# EAGLE design electrosteel2020_10_arrange6_synthboardsonly (EAGLE 9.6.2)
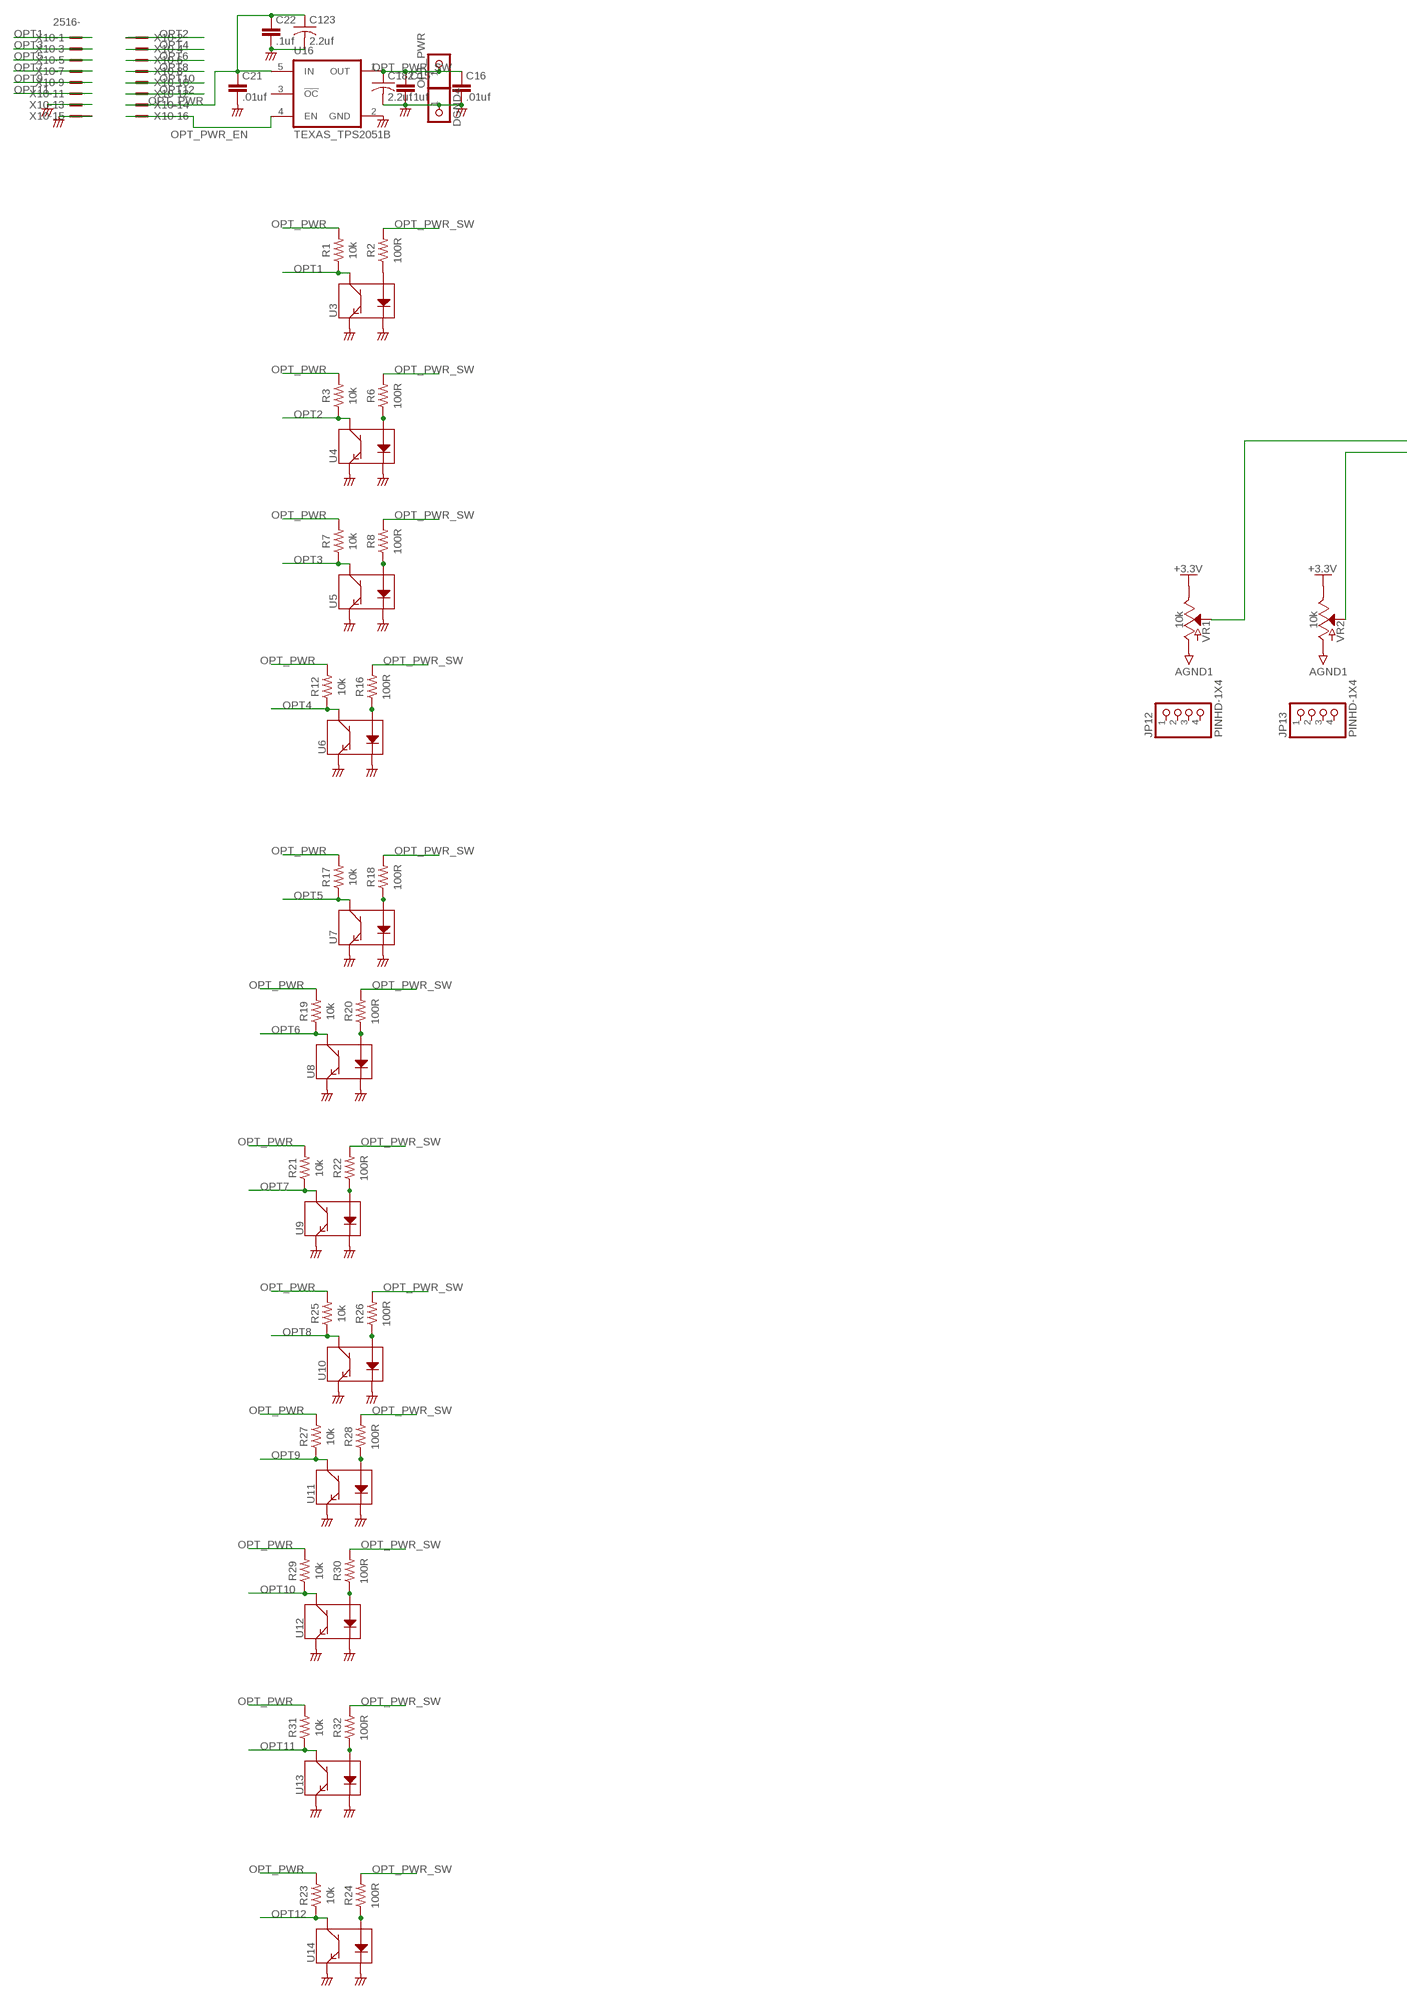
[diagram p0: schematic, sheet 1, part 1 of 3]
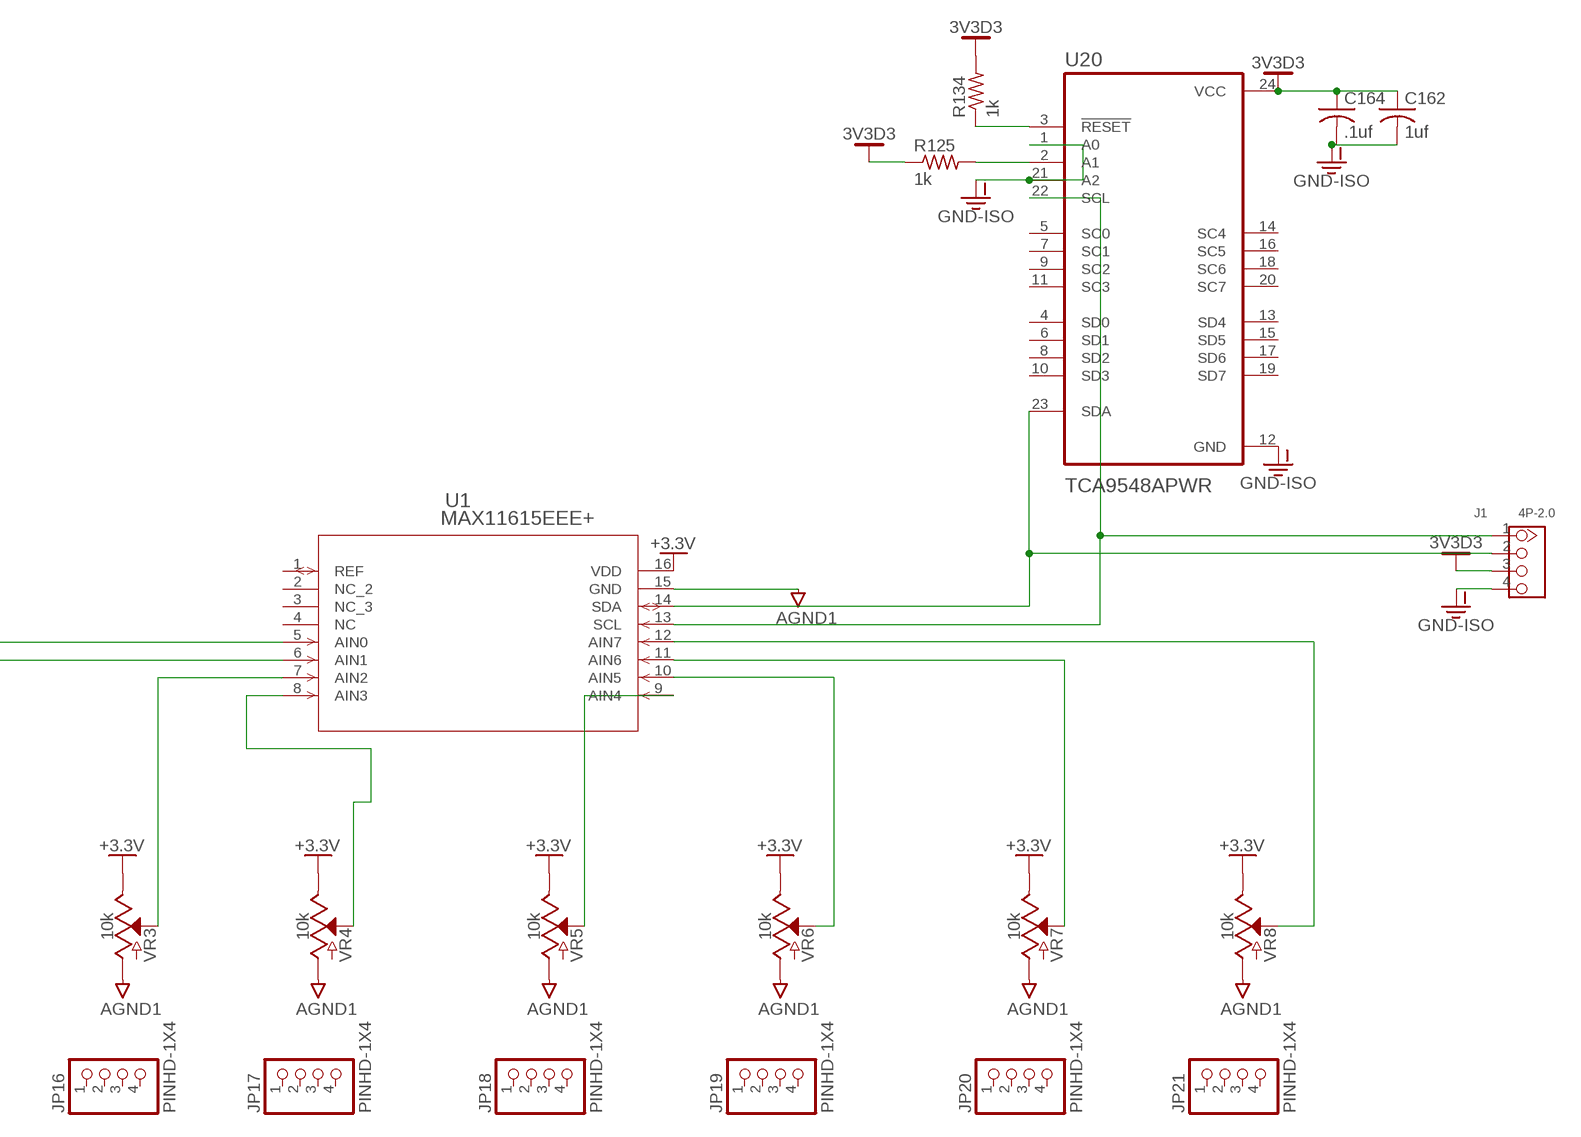
[diagram p1: schematic, sheet 1, part 2 of 3]
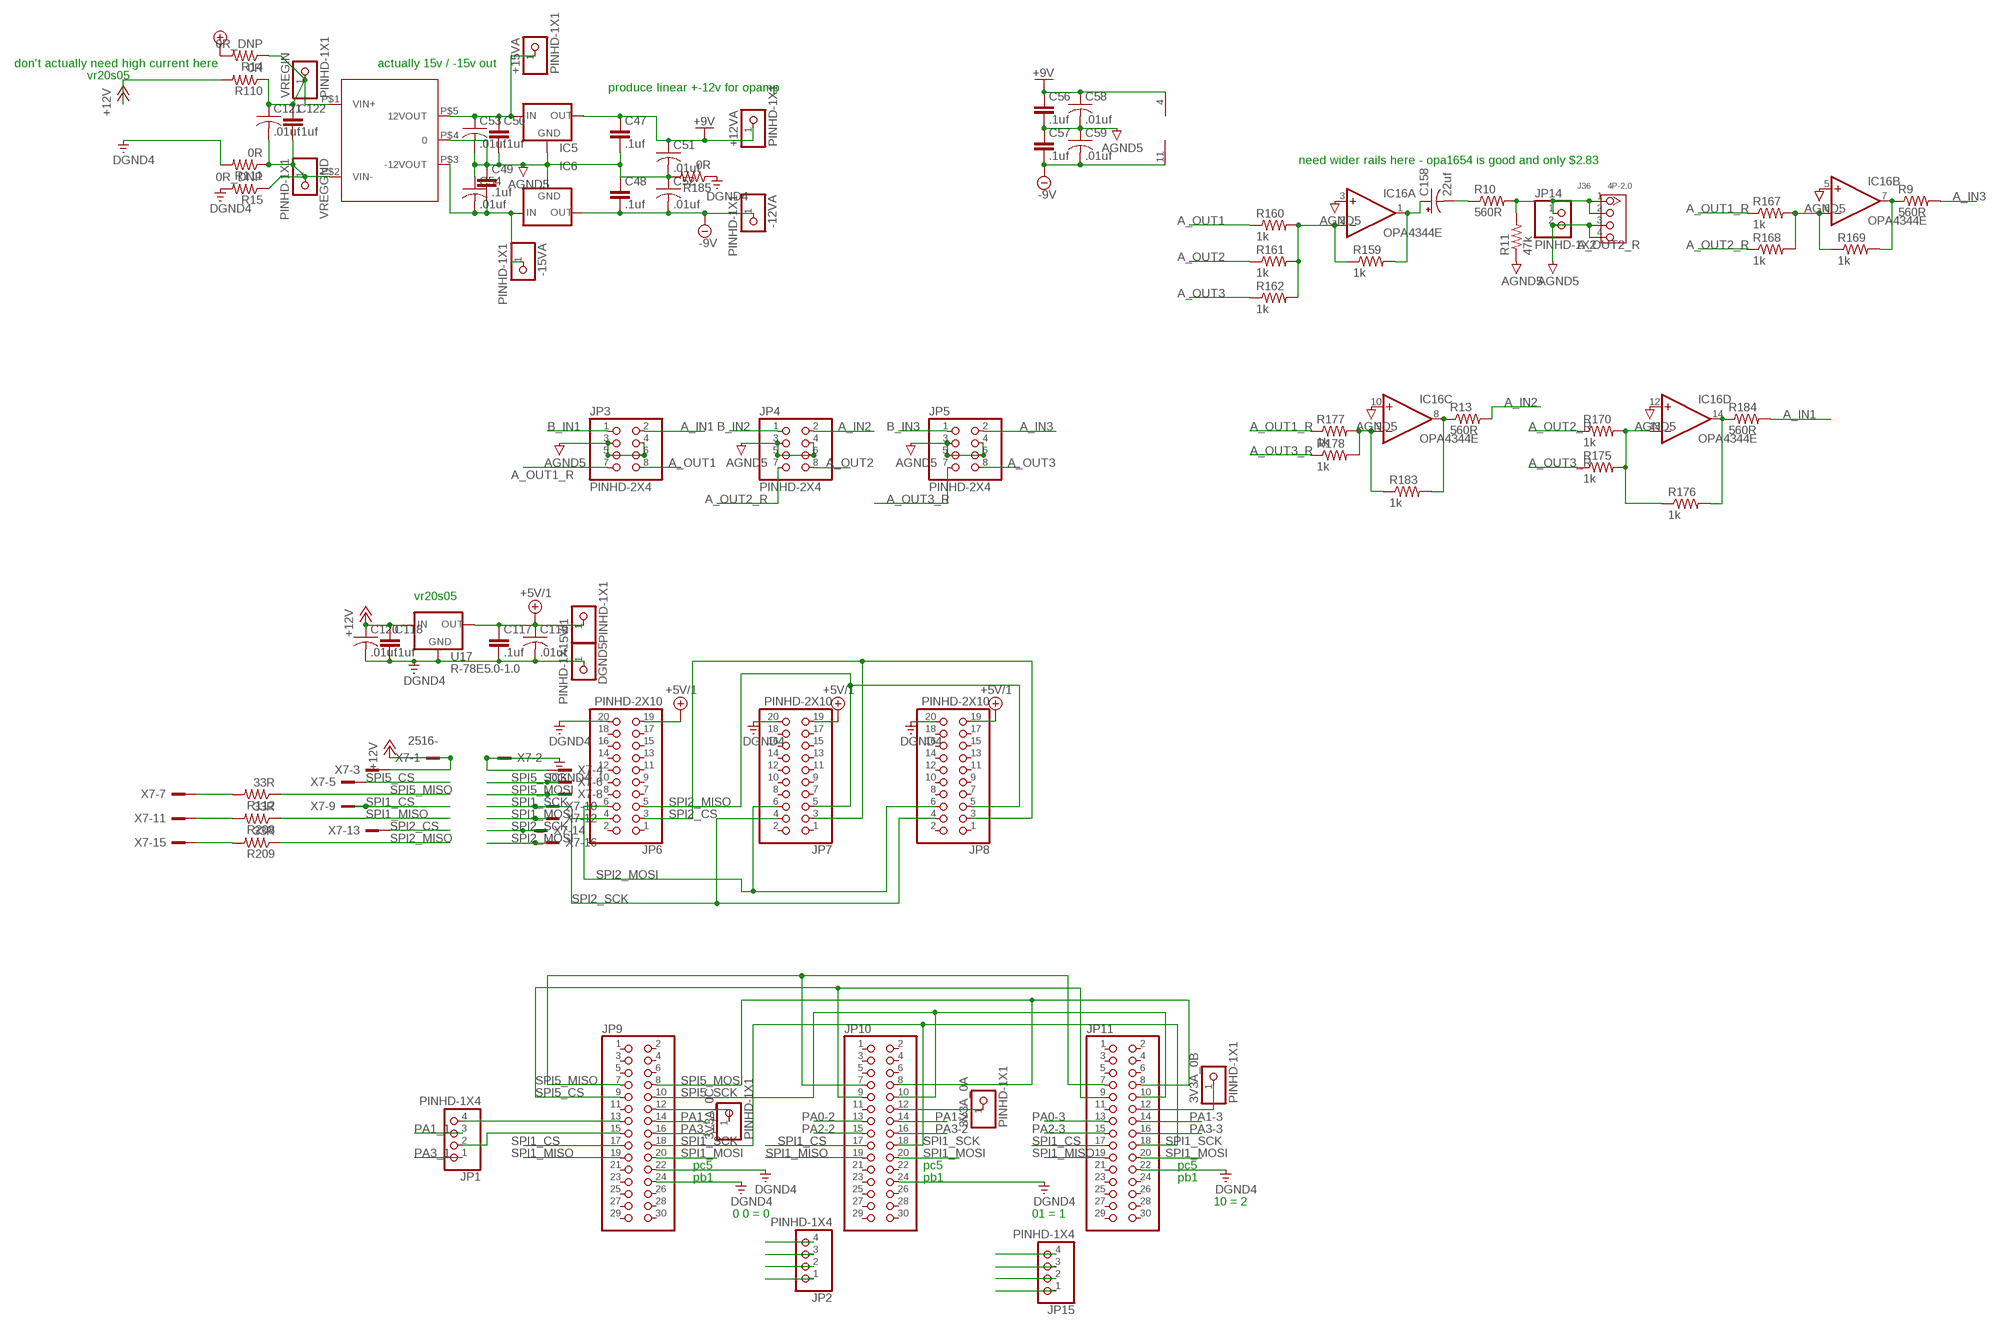
[diagram p2: schematic, sheet 1, part 3 of 3]

## Parts
3V3A_0A  PINHD-1X1  [1X01]
3V3A_0B  PINHD-1X1  [1X01]
3V3A_0C  PINHD-1X1  [1X01]
5V/1  PINHD-1X1  [1X01]
+12VA  PINHD-1X1  [1X01]
+15VA  PINHD-1X1  [1X01]
-12VA  PINHD-1X1  [1X01]
-15VA  PINHD-1X1  [1X01]
C15  .1uf  CAP_0402  [0402]
C16  .01uf  CAP_0402  [0402]
C21  .01uf  CAP_0402  [0402]
C22  .1uf  CAP_0402  [0402]
C47  .1uf  CAP_0402  [0402]
C48  .1uf  CAP_0402  [0402]
C49  .1uf  CAP_0402  [0402]
C50  .1uf  CAP_0402  [0402]
C51  .01uf  C-USC0201  [C0201]
C52  .01uf  C-USC0201  [C0201]
C53  .01uf  C-USC0201  [C0201]
C54  .01uf  C-USC0201  [C0201]
C56  .1uf  CAP_0402  [0402]
C57  .1uf  CAP_0402  [0402]
C58  .01uf  C-USC0201  [C0201]
C59  .01uf  C-USC0201  [C0201]
C117  .1uf  CAP_0402  [0402]
C118  .1uf  CAP_0402  [0402]
C119  .01uf  C-USC0201  [C0201]
C120  .01uf  C-USC0201  [C0201]
C121  .01uf  C-USC0201  [C0201]
C122  .1uf  CAP_0402  [0402]
C123  2.2uf  C-USC1206  [C1206]
C158  22uf  CPOL-USD  [PANASONIC_D]
C162  1uf  C-USC1206K  [C1206K]
C164  .1uf  C-USC0603K  [C0603K]
C182  2.2uf  C-USC1206  [C1206]
DGND4  PINHD-1X1  [1X01]
DGND5  PINHD-1X1  [1X01]
IC5  78LXX  [78LXX]
IC6  79LXX  [79LXX]
IC16  OPA4344E  [TSSOP14]
J1  4P-2.0  GROVE-CONNECTOR-DIP(4P-2.0)  [HW4-2.0]
J36  4P-2.0  GROVE-CONNECTOR-DIP(4P-2.0)  [HW4-2.0]
JP1  PINHD-1X4  [1X04]
JP2  PINHD-1X4  [1X04]
JP3  PINHD-2X4  [2X04]
JP4  PINHD-2X4  [2X04]
JP5  PINHD-2X4  [2X04]
JP6  PINHD-2X10  [2X10]
JP7  PINHD-2X10  [2X10]
JP8  PINHD-2X10  [2X10]
JP9  PINHD-2X15  [2X15]
JP10  PINHD-2X15  [2X15]
JP11  PINHD-2X15  [2X15]
JP12  PINHD-1X4  [1X04]
JP13  PINHD-1X4  [1X04]
JP14  PINHD-1X2  [1X02]
JP15  PINHD-1X4  [1X04]
JP16  PINHD-1X4  [1X04]
JP17  PINHD-1X4  [1X04]
JP18  PINHD-1X4  [1X04]
JP19  PINHD-1X4  [1X04]
JP20  PINHD-1X4  [1X04]
JP21  PINHD-1X4  [1X04]
OPT_PWR  PINHD-1X1  [1X01]
R1  10k  R-US_CHIP-0603(1608-METRIC)  [RESC1608X60]
R2  100R  R-US_CHIP-0603(1608-METRIC)  [RESC1608X60]
R3  10k  R-US_CHIP-0603(1608-METRIC)  [RESC1608X60]
R6  100R  R-US_CHIP-0603(1608-METRIC)  [RESC1608X60]
R7  10k  R-US_CHIP-0603(1608-METRIC)  [RESC1608X60]
R8  100R  R-US_CHIP-0603(1608-METRIC)  [RESC1608X60]
R9  560R  R-US_R0603  [R0603]
R10  560R  R-US_R0603  [R0603]
R11  47k  R-US_R0603  [R0603]
R12  10k  R-US_CHIP-0603(1608-METRIC)  [RESC1608X60]
R13  560R  R-US_R0603  [R0603]
R14  0R_DNP  R-US_R0603  [R0603]
R15  0R_DNP  R-US_R0603  [R0603]
R16  100R  R-US_CHIP-0603(1608-METRIC)  [RESC1608X60]
R17  10k  R-US_CHIP-0603(1608-METRIC)  [RESC1608X60]
R18  100R  R-US_CHIP-0603(1608-METRIC)  [RESC1608X60]
R19  10k  R-US_CHIP-0603(1608-METRIC)  [RESC1608X60]
R20  100R  R-US_CHIP-0603(1608-METRIC)  [RESC1608X60]
R21  10k  R-US_CHIP-0603(1608-METRIC)  [RESC1608X60]
R22  100R  R-US_CHIP-0603(1608-METRIC)  [RESC1608X60]
R23  10k  R-US_CHIP-0603(1608-METRIC)  [RESC1608X60]
R24  100R  R-US_CHIP-0603(1608-METRIC)  [RESC1608X60]
R25  10k  R-US_CHIP-0603(1608-METRIC)  [RESC1608X60]
R26  100R  R-US_CHIP-0603(1608-METRIC)  [RESC1608X60]
R27  10k  R-US_CHIP-0603(1608-METRIC)  [RESC1608X60]
R28  100R  R-US_CHIP-0603(1608-METRIC)  [RESC1608X60]
R29  10k  R-US_CHIP-0603(1608-METRIC)  [RESC1608X60]
R30  100R  R-US_CHIP-0603(1608-METRIC)  [RESC1608X60]
R31  10k  R-US_CHIP-0603(1608-METRIC)  [RESC1608X60]
R32  100R  R-US_CHIP-0603(1608-METRIC)  [RESC1608X60]
R110  0R  R-US_R0603  [R0603]
R111  0R  R-US_R0603  [R0603]
R112  33R  R-US_R0201  [R0201]
R125  1k  R-US_R0603  [R0603]
R134  1k  R-US_R0603  [R0603]
R159  1k  R-US_R0603  [R0603]
R160  1k  R-US_R0603  [R0603]
R161  1k  R-US_R0603  [R0603]
R162  1k  R-US_R0603  [R0603]
R167  1k  R-US_R0603  [R0603]
R168  1k  R-US_R0603  [R0603]
R169  1k  R-US_R0603  [R0603]
R170  1k  R-US_R0603  [R0603]
R175  1k  R-US_R0603  [R0603]
R176  1k  R-US_R0603  [R0603]
R177  1k  R-US_R0603  [R0603]
R178  1k  R-US_R0603  [R0603]
R183  1k  R-US_R0603  [R0603]
R184  560R  R-US_R0603  [R0603]
R185  0R  R-US_R0603  [R0603]
R208  33R  R-US_R0201  [R0201]
R209  33R  R-US_R0201  [R0201]
U1  MAX11615EEE+  [21-0055H_16_MXM]
U3  QRE1113  [QRE1113]
U4  QRE1113  [QRE1113]
U5  QRE1113  [QRE1113]
U6  QRE1113  [QRE1113]
U7  QRE1113  [QRE1113]
U8  QRE1113  [QRE1113]
U9  QRE1113  [QRE1113]
U10  QRE1113  [QRE1113]
U11  QRE1113  [QRE1113]
U12  QRE1113  [QRE1113]
U13  QRE1113  [QRE1113]
U14  QRE1113  [QRE1113]
U16  TEXAS_TPS2051B  [TEXAS_SOT23-5]
U17  R-78E5.0-1.0  [DC-DC_CONVERTER_78XX]
U20  TCA9548APWR  [SOP65P640X120-24N]
U$3  CMR0512S3C  [CMR0512S3C]
VR1  10k  POTENTIOMETER-PTH-9MM-1/20W-20%  [POT-PTH-ALPS]
VR2  10k  POTENTIOMETER-PTH-9MM-1/20W-20%  [POT-PTH-ALPS]
VR3  10k  POTENTIOMETER-PTH-9MM-1/20W-20%  [POT-PTH-ALPS]
VR4  10k  POTENTIOMETER-PTH-9MM-1/20W-20%  [POT-PTH-ALPS]
VR5  10k  POTENTIOMETER-PTH-9MM-1/20W-20%  [POT-PTH-ALPS]
VR6  10k  POTENTIOMETER-PTH-9MM-1/20W-20%  [POT-PTH-ALPS]
VR7  10k  POTENTIOMETER-PTH-9MM-1/20W-20%  [POT-PTH-ALPS]
VR8  10k  POTENTIOMETER-PTH-9MM-1/20W-20%  [POT-PTH-ALPS]
VREGGND  PINHD-1X1  [1X01]
VREGIN  PINHD-1X1  [1X01]
X7  2516-  [PAK100/2500-16]
X10  2516-  [PAK100/2500-16]

## Nets
3V3D3: C162.1 C164.1 J1.3 R125.1 R134.2 U20.24(VCC)
+3.3V: U1.16(VDD) VR1.P$1(E) VR2.P$1(E) VR3.P$1(E) VR4.P$1(E) VR5.P$1(E) VR6.P$1(E) VR7.P$1(E) VR8.P$1(E)
+5V/1: 5V/1.1 C117.1 C119.1 JP6.19 JP7.19 JP8.19 R14.2 U17.VOUT(OUT)
+9V: +12VA.1 C47.1 C51.1 C56.1 C58.1 IC5.OUT IC16.4(P:V+)
+12V: C118.1 C120.1 R110.2 U17.VIN(IN) X7.1 X7.3
-9V: -12VA.1 C48.2 C52.2 C57.2 C59.2 IC6.OUT IC16.11(P:V-)
A_IN1: JP3.2 R184.2
A_IN2: JP4.2 R13.2
A_IN3: JP5.2 R9.2
A_OUT1: JP3.8 R160.1
A_OUT1_R: JP3.7 R167.1 R177.1
A_OUT2: JP4.8 R161.1
A_OUT2_R: JP4.7 R168.1 R170.1
A_OUT3: JP5.8 R162.1
A_OUT3_R: JP5.7 R175.1 R178.1
AGND1: U1.15(GND) VR1.P$3(A) VR2.P$3(A) VR3.P$3(A) VR4.P$3(A) VR5.P$3(A) VR6.P$3(A) VR7.P$3(A) VR8.P$3(A)
AGND5: C47.2 C48.1 C49.1 C50.2 C51.2 C52.1 C53.2 C54.1 C56.2 C57.1 C58.2 C59.1 IC5.GND IC6.GND IC16.3(A:+IN) IC16.5(B:+IN) IC16.10(C:+IN) IC16.12(D:+IN) J36.3 J36.4 JP3.3 JP3.4 JP3.5 JP3.6 JP4.3 JP4.4 JP4.5 JP4.6 JP5.3 JP5.4 JP5.5 JP5.6 JP14.2 R11.1 R185.2 U$3.P$4
B_IN1: JP3.1
B_IN2: JP4.1
B_IN3: JP5.1
CGND: C15.2 C16.2 C21.2 C22.2 C123.2 C182.2 DGND4.1 U3.2(K) U3.4(E) U4.2(K) U4.4(E) U5.2(K) U5.4(E) U6.2(K) U6.4(E) U7.2(K) U7.4(E) U8.2(K) U8.4(E) U9.2(K) U9.4(E) U10.2(K) U10.4(E) U11.2(K) U11.4(E) U12.2(K) U12.4(E) U13.2(K) U13.4(E) U14.2(K) U14.4(E) U16.2(GND) X10.13 X10.15 ; supply symbol labelled SUPPLY0_CGND_
DGND4: C117.2 C118.2 C119.2 C120.2 DGND5.1 JP6.20 JP7.20 JP8.20 JP9.22 JP9.24 JP10.24 JP11.22 R15.2 R111.2 R185.1 U17.GND X7.2 X7.4
GND-ISO: C162.2 C164.2 J1.4 U20.1(A0) U20.12(GND) U20.21(A2)
N$1: R6.1 U4.1(A)
N$2: R2.1 U3.1(A)
N$3: U1.5(AIN0) VR1.P$2(S)
N$4: U1.6(AIN1) VR2.P$2(S)
N$5: U1.7(AIN2) VR3.P$2(S)
N$6: U1.8(AIN3) VR4.P$2(S)
N$7: R8.1 U5.1(A)
N$8: U1.9(AIN4) VR5.P$2(S)
N$9: U1.10(AIN5) VR6.P$2(S)
N$10: IC16.6(B:-IN) R167.2 R168.2 R169.1
N$11: U1.11(AIN6) VR7.P$2(S)
N$12: U1.12(AIN7) VR8.P$2(S)
N$13: J1.2 U1.14(SDA) U20.23(SDA)
N$14: J1.1 U1.13(SCL) U20.22(SCL)
N$15: R125.2 U20.2(A1)
N$27: IC16.2(A:-IN) R159.1 R160.2 R161.2 R162.2
N$28: IC16.7(B:OUT) R9.1 R169.2
N$29: IC16.9(C:-IN) R177.2 R178.2 R183.1
N$30: +15VA.1 C50.1 C53.1 IC5.IN U$3.P$5(12VOUT)
N$32: C158.+ IC16.1(A:OUT) R159.2
N$33: R16.1 U6.1(A)
N$34: -15VA.1 C49.2 C54.2 IC6.IN U$3.P$3(-12VOUT)
N$35: R18.1 U7.1(A)
N$36: R20.1 U8.1(A)
N$37: R22.1 U9.1(A)
N$38: R24.1 U14.1(A)
N$39: R26.1 U10.1(A)
N$40: R28.1 U11.1(A)
N$41: R30.1 U12.1(A)
N$42: R32.1 U13.1(A)
N$105: C121.2 C122.2 R15.1 R111.1 U$3.P$2(VIN-) VREGGND.1
N$106: C121.1 C122.1 R14.1 R110.1 U$3.P$1(VIN+) VREGIN.1
N$174: R134.1 U20.3(!RESET)
N$246: IC16.8(C:OUT) R13.1 R183.2
N$249: C158.- R10.1
N$251: IC16.14(D:OUT) R176.2 R184.1
N$252: IC16.13(D:-IN) R170.2 R175.2 R176.1
N$265: J36.1 J36.2 JP14.1 R10.2 R11.2
N$284: R209.2 X7.15
N$293: R208.2 X7.11
N$294: R112.2 X7.7
N$298: JP1.4 JP9.13
N$299: 3V3A_0C.1 JP9.12
N$300: JP1.2 JP9.15
N$309: 3V3A_0A.1 JP10.12
N$310: 3V3A_0B.1 JP11.12
OPT1: R1.1 U3.3(C) X10.1
OPT2: R3.1 U4.3(C) X10.2
OPT3: R7.1 U5.3(C) X10.3
OPT4: R12.1 U6.3(C) X10.4
OPT5: R17.1 U7.3(C) X10.5
OPT6: R19.1 U8.3(C) X10.6
OPT7: R21.1 U9.3(C) X10.7
OPT8: R25.1 U10.3(C) X10.8
OPT9: R27.1 U11.3(C) X10.9
OPT10: R29.1 U12.3(C) X10.10
OPT11: R31.1 U13.3(C) X10.11
OPT12: R23.1 U14.3(C) X10.12
OPT_PWR: C21.1 C22.1 C123.1 R1.2 R3.2 R7.2 R12.2 R17.2 R19.2 R21.2 R23.2 R25.2 R27.2 R29.2 R31.2 U16.5(IN) X10.14
OPT_PWR_EN: U16.4(EN) X10.16
OPT_PWR_SW: C15.1 C16.1 C182.1 OPT_PWR.1 R2.2 R6.2 R8.2 R16.2 R18.2 R20.2 R22.2 R24.2 R26.2 R28.2 R30.2 R32.2 U16.1(OUT)
PA0-2: JP2.4 JP10.13
PA0-3: JP11.13 JP15.4
PA1-2: JP2.3 JP10.14
PA1-3: JP11.14 JP15.3
PA1_1: JP1.3 JP9.14
PA2-2: JP2.2 JP10.15
PA2-3: JP11.15 JP15.2
PA3-2: JP2.1 JP10.16
PA3-3: JP11.16 JP15.1
PA3_1: JP1.1 JP9.16
SPI1_CS: JP9.17 JP10.17 JP11.17 X7.9
SPI1_MISO: JP9.19 JP10.19 JP11.19 R208.1
SPI1_MOSI: JP9.20 JP10.20 JP11.20 X7.12
SPI1_SCK: JP9.18 JP10.18 JP11.18 X7.10
SPI2_CS: JP6.3 JP7.3 JP8.3 X7.13
SPI2_MISO: JP6.5 JP7.5 JP8.5 R209.1
SPI2_MOSI: JP6.6 JP7.6 JP8.6 X7.16
SPI2_SCK: JP6.4 JP7.4 JP8.4 X7.14
SPI5_CS: JP9.9 JP10.9 JP11.9 X7.5
SPI5_MISO: JP9.7 JP10.7 JP11.7 R112.1
SPI5_MOSI: JP9.8 JP10.8 JP11.8 X7.8
SPI5_SCK: JP9.10 JP10.10 JP11.10 X7.6
Unconnected: JP6.1 JP6.2 JP6.7 JP6.8 JP6.9 JP6.10 JP6.11 JP6.12 JP6.13 JP6.14 JP6.15 JP6.16 JP6.17 JP6.18 JP7.1 JP7.2 JP7.7 JP7.8 JP7.9 JP7.10 JP7.11 JP7.12 JP7.13 JP7.14 JP7.15 JP7.16 JP7.17 JP7.18 JP8.1 JP8.2 JP8.7 JP8.8 JP8.9 JP8.10 JP8.11 JP8.12 JP8.13 JP8.14 JP8.15 JP8.16 JP8.17 JP8.18 JP9.1 JP9.2 JP9.3 JP9.4 JP9.5 JP9.6 JP9.11 JP9.21 JP9.23 JP9.25 JP9.26 JP9.27 JP9.28 JP9.29 JP9.30 JP10.1 JP10.2 JP10.3 JP10.4 JP10.5 JP10.6 JP10.11 JP10.21 JP10.22 JP10.23 JP10.25 JP10.26 JP10.27 JP10.28 JP10.29 JP10.30 JP11.1 JP11.2 JP11.3 JP11.4 JP11.5 JP11.6 JP11.11 JP11.21 JP11.23 JP11.24 JP11.25 JP11.26 JP11.27 JP11.28 JP11.29 JP11.30 JP12.1 JP12.2 JP12.3 JP12.4 JP13.1 JP13.2 JP13.3 JP13.4 JP16.1 JP16.2 JP16.3 JP16.4 JP17.1 JP17.2 JP17.3 JP17.4 JP18.1 JP18.2 JP18.3 JP18.4 JP19.1 JP19.2 JP19.3 JP19.4 JP20.1 JP20.2 JP20.3 JP20.4 JP21.1 JP21.2 JP21.3 JP21.4 U1.1(REF) U1.2(NC_2) U1.3(NC_3) U1.4(NC) U16.3(!OC!) U20.4(SD0) U20.5(SC0) U20.6(SD1) U20.7(SC1) U20.8(SD2) U20.9(SC2) U20.10(SD3) U20.11(SC3) U20.13(SD4) U20.14(SC4) U20.15(SD5) U20.16(SC5) U20.17(SD6) U20.18(SC6) U20.19(SD7) U20.20(SC7)

## Notes on the sheet
- don't actually need high current here | actually 15v / -15v out
- vr20s05
- produce linear +-12v for opamp
- need wider rails here - opa1654 is good and only $2.83
- vr20s05
- pc5 | pc5 | pc5
- pb1 | pb1 | pb1
- 10 = 2
- 0 0 = 0 | 01 = 1

## Library data of the parts
3V3A_0A 3V3A_0B 3V3A_0C 5V/1 +12VA +15VA -12VA -15VA DGND5 VREGGND VREGIN = Connector:PINHD-1X1: PIN HEADER; CATEGORY: CONNECTOR; PARTNO: *DNP; SUB-CATEGORY: PIN-HEADER
C15 C22 C47-C50 C56 C57 C117 C118 C122 = Perfect_0402:CAP_0402: 0402 (1005 Metric) Nick Garner - TeleSense; PARTNO: CC0402KRX7R8BB104
C16 C21 = Perfect_0402:CAP_0402: 0402 (1005 Metric) Nick Garner - TeleSense; PARTNO: CC0402KRX7R8BB103
C51-C54 C58 C59 C119-C121 = rcl:C-US: CAPACITOR, American symbol; PARTNO: TMK063B7103KP-F; SPICEPREFIX: C
C123 C182 = adafruit:C-US: CAPACITOR, American symbol; PARTNO: T491A225K020AT
C158 = adafruit:CPOL-US: POLARIZED CAPACITOR, American symbol; PARTNO: EEE-1CA220NP
C162 = adafruit:C-US: CAPACITOR, American symbol; PARTNO: C3216X7R1E105K085AA
C164 = adafruit:C-US: CAPACITOR, American symbol; PARTNO: CC0603KRX7R8BB104
DGND4 OPT_PWR = adafruit:PINHD-1X1: Pin header 1x1 for 0.1" spacing With round pins; PARTNO: *DNP
IC5 = v-reg:78LXX: VOLTAGE REGULATOR; PARTNO: LM78L12ACZ/LFT7
IC6 = v-reg:79LXX: VOLTAGE REGULATOR; PARTNO: L79L12ACZ-TR
IC16 = linear:OPA4*: Quad Operational Amplifier compatible with: TLC27L4 Low Power, Single-Supply, Rail-To-Rail Operational Amplifier Source: http://focus.ti.com/lit/ds/symlink/opa2345.pdf http://focus.ti.com .. opa241.pdf http://focus.ti.com .. tlc27l4.pdf http://focus.ti.com/lit/ds/symlink/opa2134.pdf; PARTNO: OPA1654AIPWR
J1 J36 = OPL_Connector:GROVE-CONNECTOR-DIP(4P-2.0): 320110033; PARTNO: 110990030
JP1 JP2 JP12 JP13 JP15-JP21 = Connector:PINHD-1X4: PIN HEADER; CATEGORY: CONNECTOR; SUB-CATEGORY: PIN-HEADER
JP3-JP5 = Connector:PINHD-2X4: PIN HEADER; CATEGORY: CONNECTOR; PARTNO: 77313-101-08LF; SUB-CATEGORY: PIN-HEADER
JP6-JP8 = Connector:PINHD-2X10: PIN HEADER; CATEGORY: CONNECTOR; PARTNO: 77313-101-20LF; SUB-CATEGORY: PIN-HEADER
JP9-JP11 = pinhead:PINHD-2X15: PIN HEADER; PARTNO: 77313-101-30LF
JP14 = Connector:PINHD-1X2: PIN HEADER; CATEGORY: CONNECTOR; PARTNO: *DNP; SUB-CATEGORY: PIN-HEADER
R1 R3 R7 R12 R17 R19 R21 R23 R25 R27 R29 R31 = Resistor:R-US: Resistor Fixed - ANSI; CATEGORY: Resistor; PARTNO: ESR03EZPF1002; SUB-CATEGORY: Fixed
R2 R6 R8 R16 R18 R20 R22 R24 R26 R28 R30 R32 = Resistor:R-US: Resistor Fixed - ANSI; CATEGORY: Resistor; PARTNO: ESR03EZPJ101; SUB-CATEGORY: Fixed
R9 R10 R13 R184 = Resistor:R-US_: RESISTOR, American symbol; PARTNO: ESR03EZPF5600
R11 = Resistor:R-US_: RESISTOR, American symbol; PARTNO: ESR03EZPJ473
R14 R15 = Resistor:R-US_: RESISTOR, American symbol; PARTNO: *DNP
R110 R111 R185 = Resistor:R-US_: RESISTOR, American symbol; PARTNO: RCS06030000Z0EA
R112 R208 R209 = rcl:R-US_: RESISTOR, American symbol; PARTNO: RC0201FR-0733RL; SPICEPREFIX: R
R125 R134 R159-R162 R167-R170 R175-R178 R183 = Resistor:R-US_: RESISTOR, American symbol; PARTNO: ESR03EZPF1001
U1 = custom:MAX11615EEE+; BUILT_BY: EMA_UL_Team; MANUFACTURER_PART_NUMBER: max11615eee+; SOURCELIBRARY: Maxim_2009-12-17_3a; VENDOR: Maxim Integrated Products
U3-U14 = SparkFun-Sensors:QRE1113: QRE1113 Reflective Object Sensor The QRE1113 is a small IR reflectance sensor. This sensor is often used in line following robots because, if it can sense if a surface is white or black. There are four pins on the QRE1113 - two control the IR emitting LED while the other two are the collector and emitter of a phototransistor. The IR diode has a max forward current of 50mA and operates at 940nm. Datasheet <http://www.sparkfun.com/datasheets/Components/SMD/QRE1113.GR.pdf> SparkFun Products IR Reflectance Sensor - QRE1113 <https://www.sparkfun.com/products/9542> (COM-09542) SparkFun Line Sensor Breakout - QRE1113 (Analog) <https://www.sparkfun.com/products/9453> (ROB-09453) SparkFun Line Sensor Breakout - QRE1113 (Digital) <https://www.sparkfun.com/products/9454> (ROB-09454) SparkFun RedBot Sensor - Line Follower <https://www.sparkfun.com/products/11769> (SEN-11769) SparkFun RedBot Sensor - Wheel Encoder <https://www.sparkfun.com/products/12617> (SEN-12617) SparkFun Line Follower Array <https://www.sparkfun.com/products/13582> (SEN-13582); PARTNO: QRE1113GR; PROD_ID: IC-09357; SF_ID: COM-09542
U16 = LinkedLibrary52101:TEXAS_TPS2051B: POWER-DISTRIBUTION SWITCH; PARTNO: TPS2051BDBVRG4
U17 = SparkFun-IC-Power:R-78E5.0-1.0: Recom Power 5V 1A DC/DC Converter The Recom R-78E5.0-X.X is a compact DC/DC converter module that is a pin for pin drop-in replacement for the LM7805 linear voltage regulator. Specifications: Input Range: 7-28V Output Voltage: 5V Output Current: 1A Max Efficiency: 91% Datasheet <https://www.recom-power.com/pdf/Innoline/R-78Exx-1.0.pdf>; PARTNO: R-78E5.0-1.0; PROD_ID: COM-13655
U20 = TCA9548APWR:TCA9548APWR: Check prices <https://pricing.snapeda.com/parts/TCA9548APWR/Texas%20Instruments/view-part?ref=eda>; AVAILABILITY: Good; DESCRIPTION: Low-Voltage 8-Channel I2C Switch With Reset 24-TSSOP -40 to 85; MF: Texas Instruments; MP: TCA9548APWR; PACKAGE: TSSOP-24 Texas Instruments; PARTNO: TCA9548APWR; PRICE: None; PURCHASE-URL: https://pricing.snapeda.com/search/part/TCA9548APWR/?ref=eda
U$3 = custom:CMR0512S3C; PARTNO: DPU01M-15
VR1-VR8 = SparkFun-Resistors:POTENTIOMETER: Potentiometer (Pot) Three-terminal potentiometers, with an adjustable wiper and two adjustable resistors. A pot can be used to create a configurable voltage divider, or as a variable resistor. Variants ALPS_POT and ALPS_POT_KIT - PTH, breadboard compatible, 9mm square pots Rotary Potentiometer - Linear (10k ohm) <https://www.sparkfun.com/products/9288> (COM-09288) The KIT variant exposes copper on only one side of the PTH pad, so the part can only be assembled on one side of the PCB. Useful for beginner soldering kits.; PROD_ID: RES-09177; SF_SKU: COM-09288
X7 X10 = con-3m:2516-: 3M (TM) Pak 100 4-Wall Header Source: 3M; OC_FARNELL: unknown; OC_NEWARK: unknown; PARTNO: D2516-6002-AR

## Board
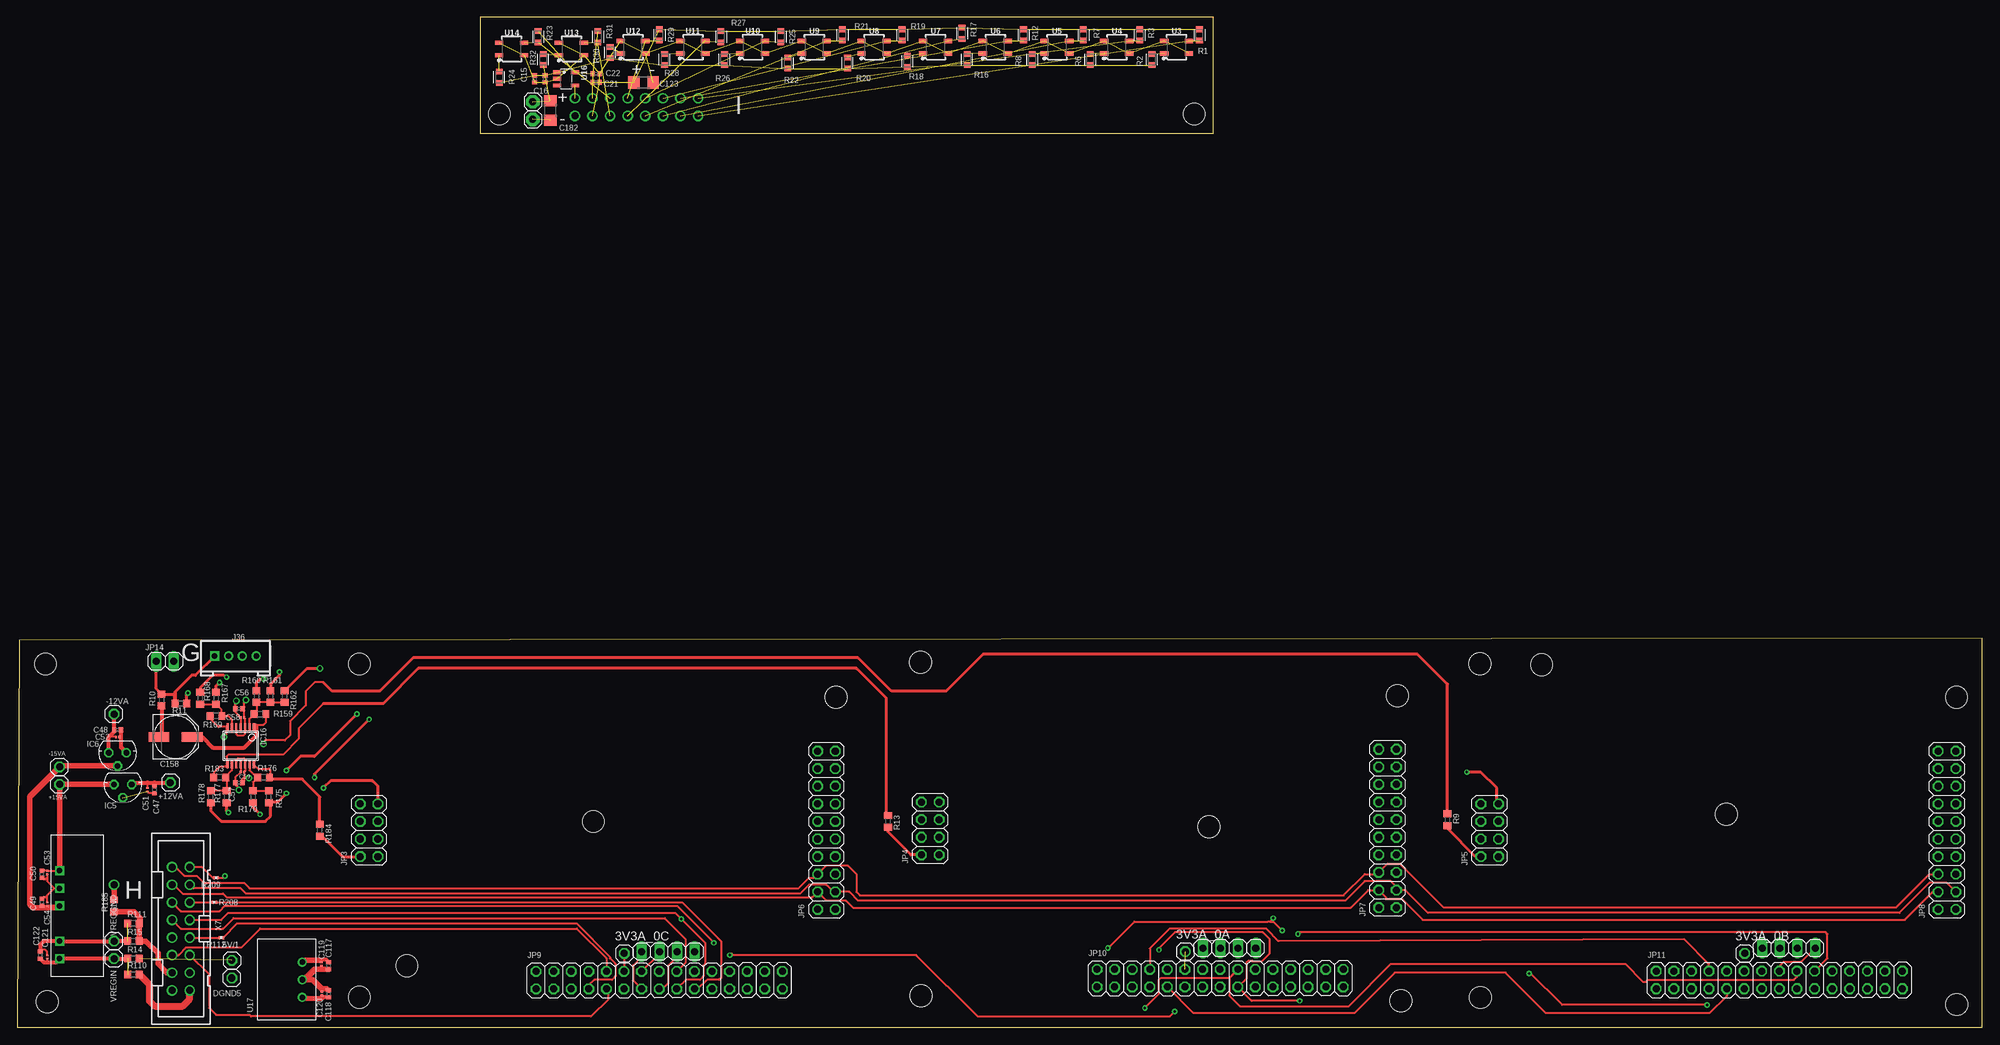
[diagram p3: board, top side]
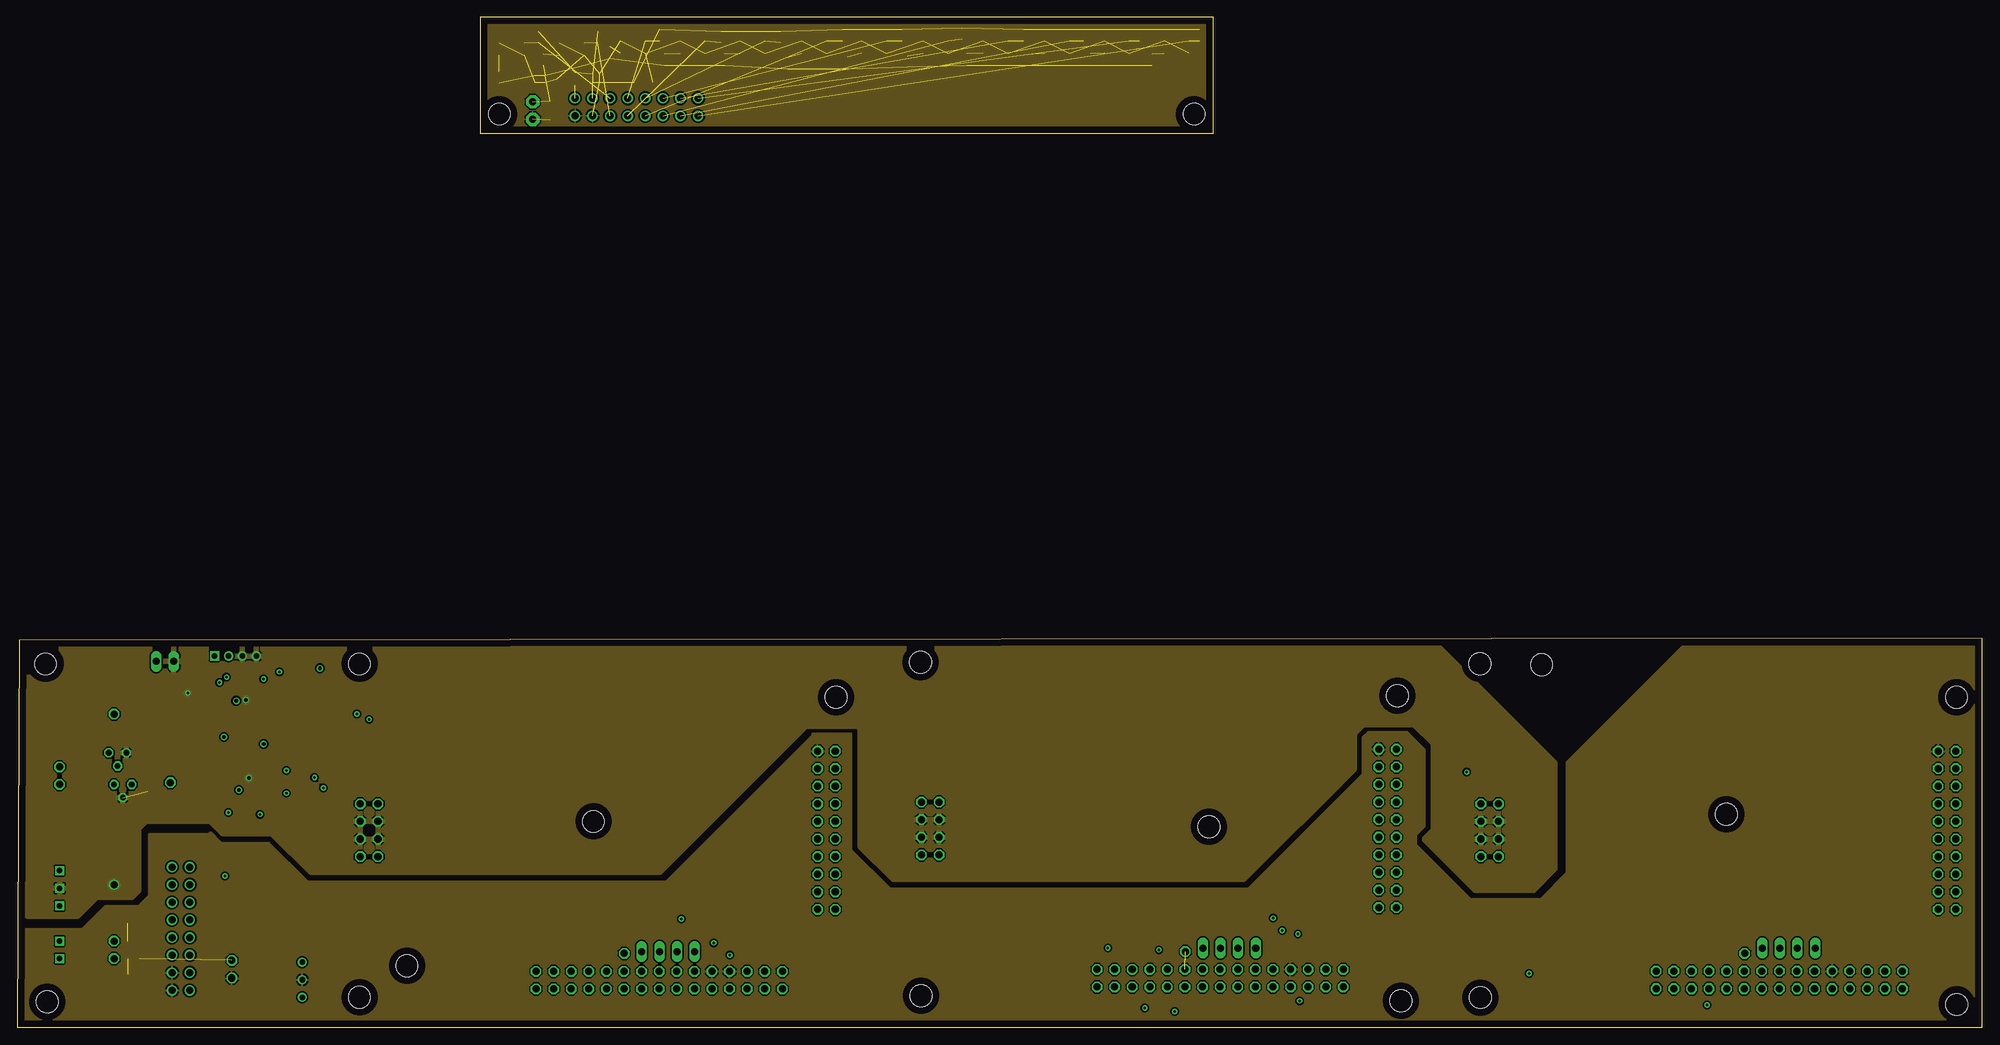
[diagram p4: board, inner layer Route2]
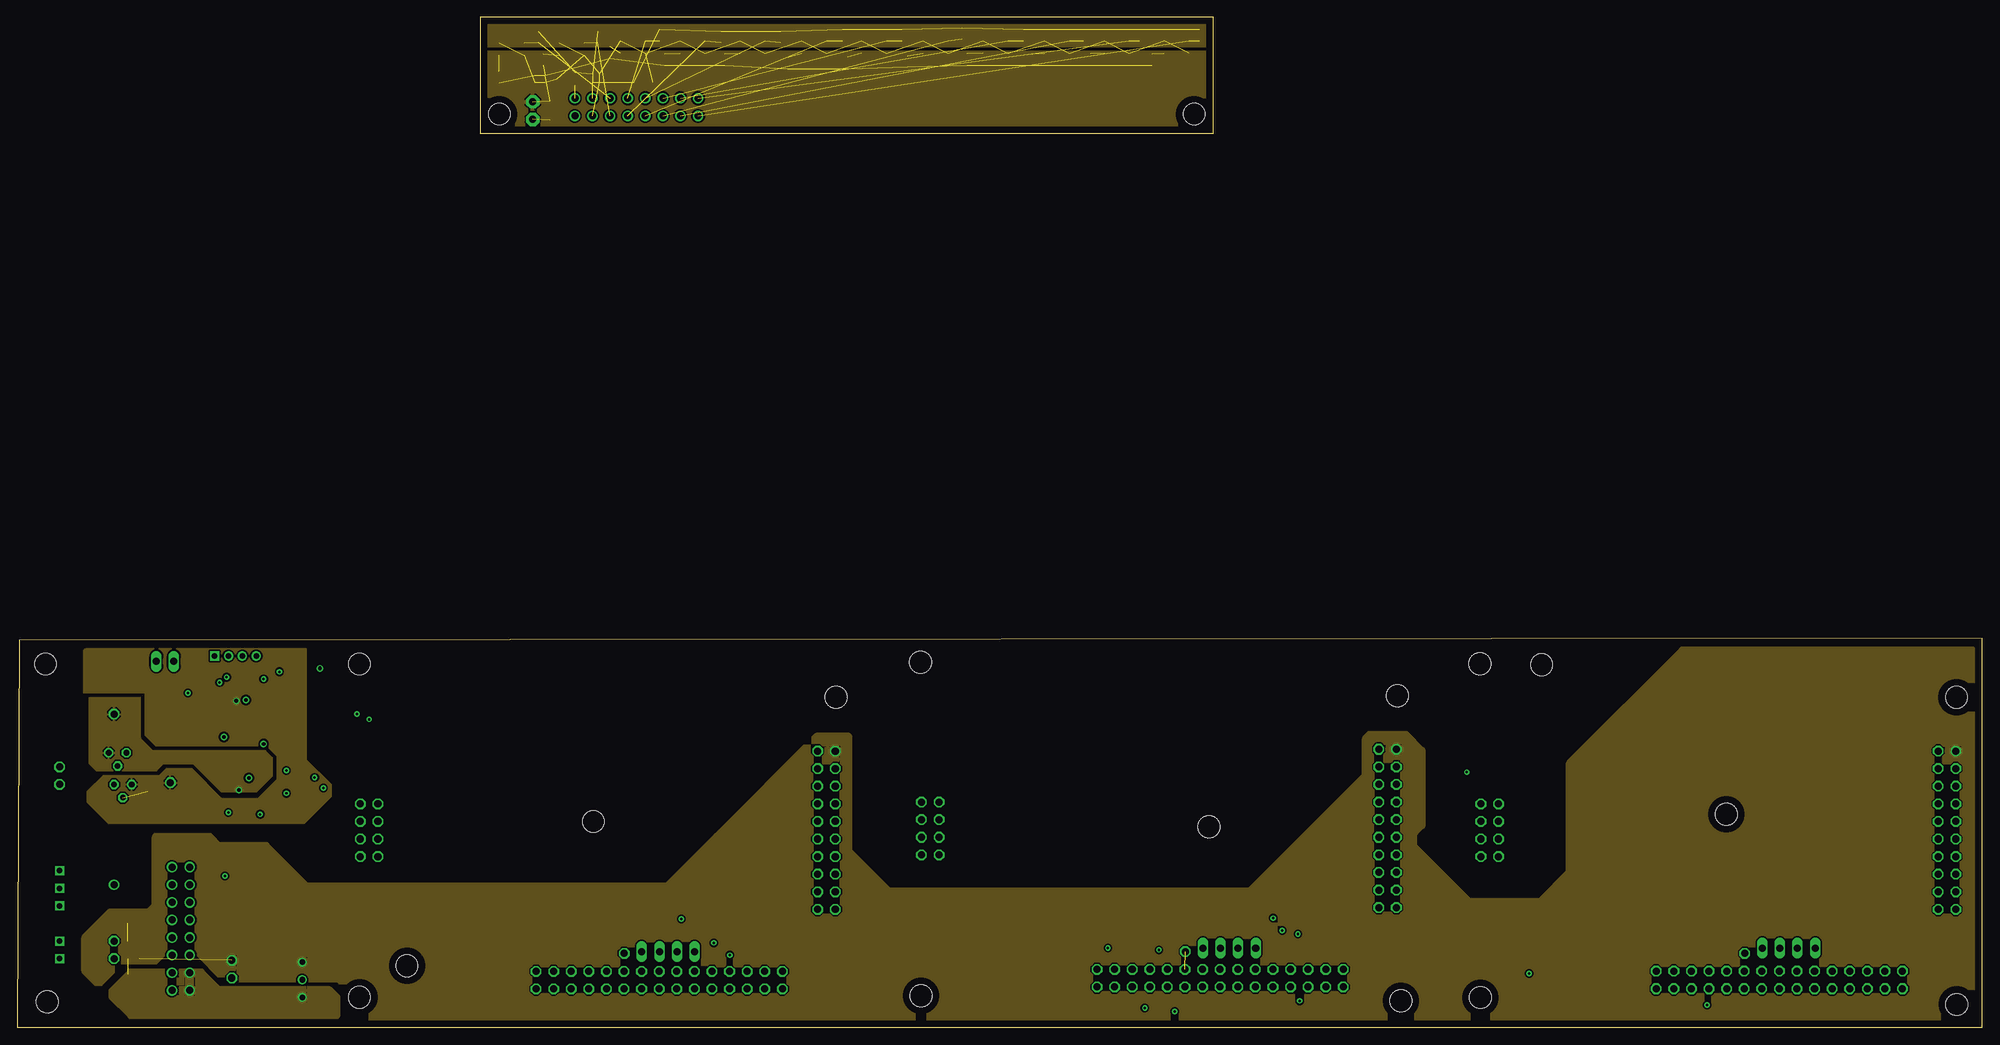
[diagram p5: board, inner layer Route15]
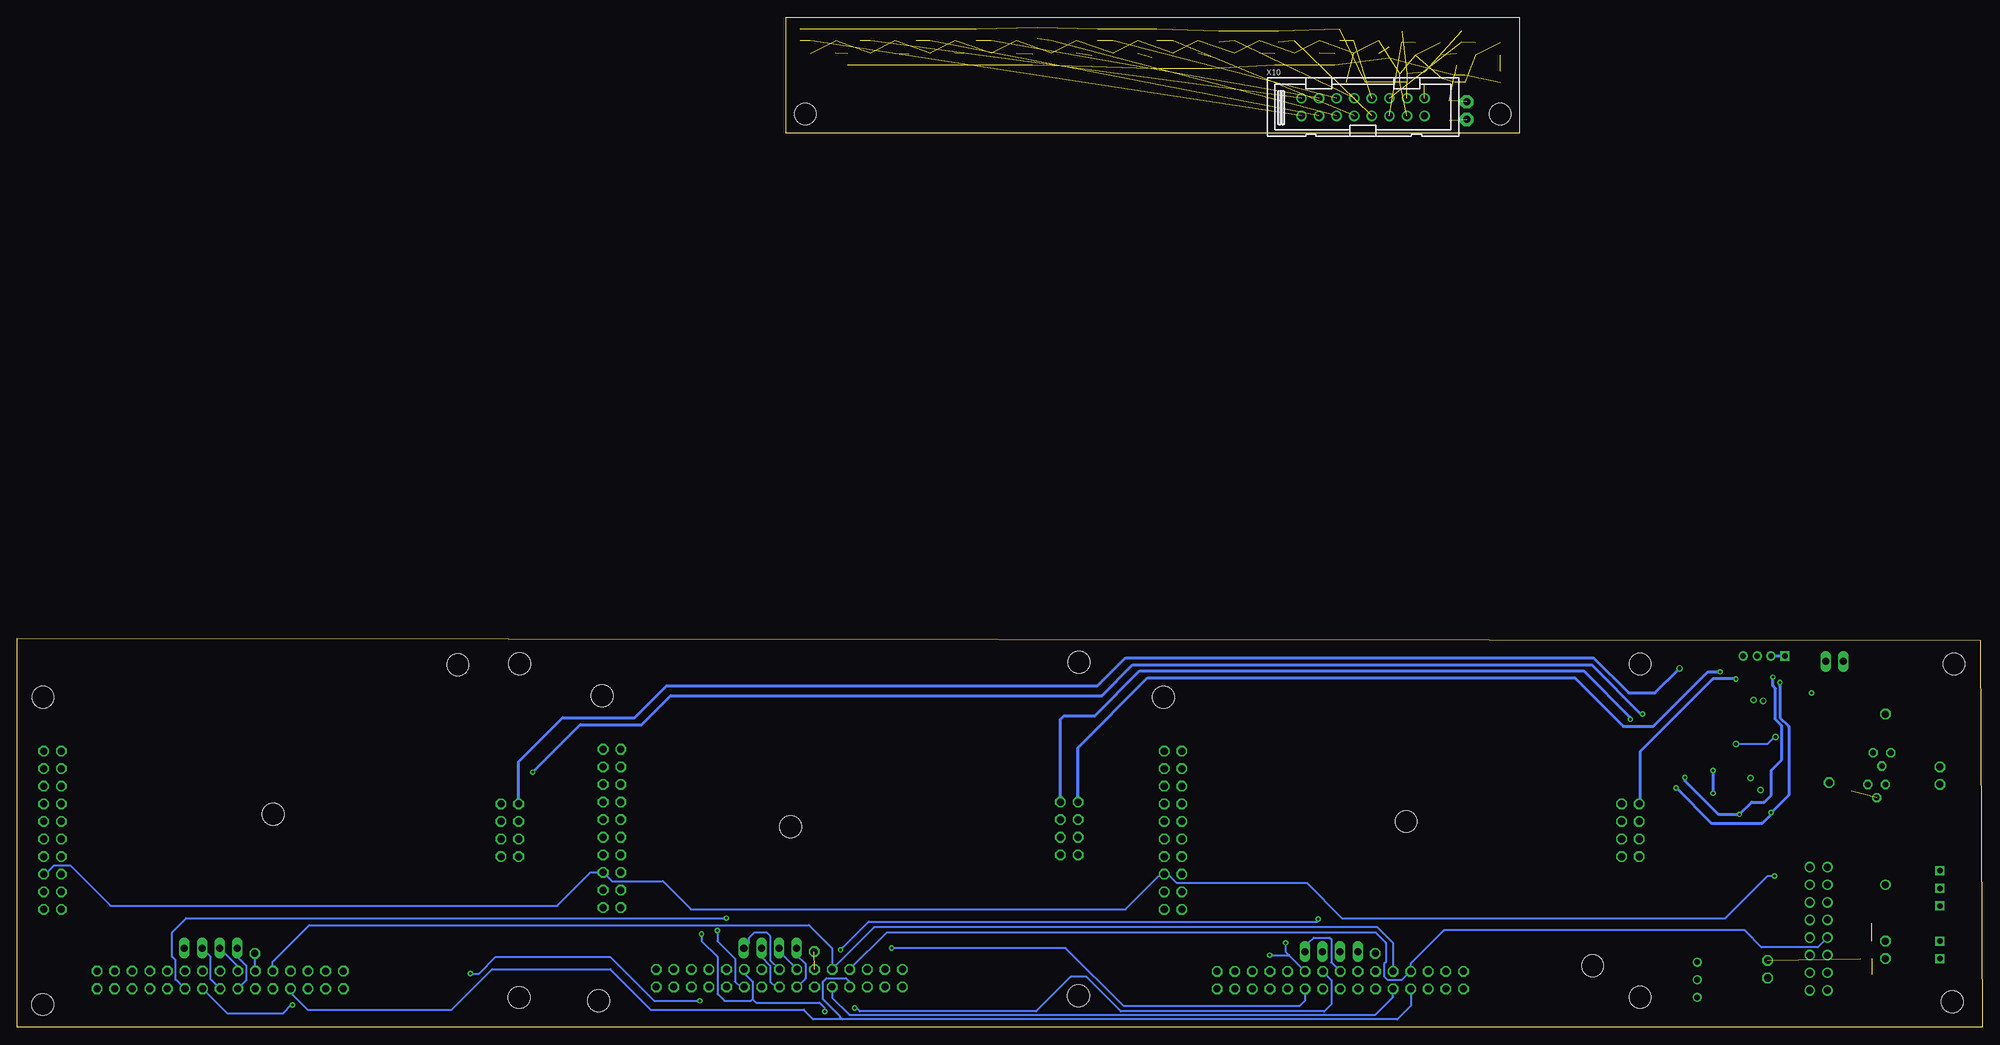
[diagram p6: board, bottom side, seen from below]

Size 283.72 x 145.8 mm. Coordinates in mm from the lower left corner, seen from the top.
Outline: 0.25,55.88 0,0 283.72,0 283.72,56.13 0.25,55.88
Outline: 172.72,129.03 172.72,145.8 66.8,145.8 66.8,129.03 172.72,129.03
Copper layers (1+2*15+16): Top 0.035mm / dielectric 0.5mm / Route2 0.035mm / dielectric 0.5mm / Route15 0.035mm / dielectric 0.5mm / Bottom 0.035mm
Design rules "default *": minimum track width 6mil, minimum drill 0.35mm, track to track 9mil, track to pad 9mil, pad to pad 9mil, via to via 9mil, smd to smd 9mil, copper to edge 40mil, drill to drill 6mil, minimum pad ring 10mil, minimum via ring 8mil, stop-mask expansion 4mil, vias tented up to drill 0mil, thermal gap 10mil
Holes 3.17 mm at 49.4,52.45 118.24,47.62 49.4,4.32 130.43,52.7 199.26,47.88 130.48,4.55 211.2,52.48 280.01,47.65 211.28,4.29 83.19,29.72 172.08,28.96 246.76,30.73 4.06,52.45 280.04,3.3 220.09,52.32 56.26,8.89 199.77,3.81 169.93,131.83 69.6,131.83 4.32,3.68
Milling: 8 lines

### Footprints (pad centres in the part's own frame; a part is rotated, then mirrored left to right if it is on the bottom)
1X01 = drill 1.016 octagon: 1 0,0
0402 = smd 0.6 x 0.7: 1 -0.5,0; 2 0.5,0
C0201 = smd 0.25 x 0.35: 1 -0.25,0; 2 0.25,0
C1206 = smd 1.6 x 1.8: 1 -1.4,0; 2 1.4,0
PANASONIC_D = smd 3 x 1.4: + 2.4,0; - -2.4,0
C1206K = smd 1.5 x 2: 1 -1.5,0; 2 1.5,0
C0603K = smd 1.05 x 1.08: 1 -0.875,0; 2 0.875,0
1X01' = drill 1.016 pad 1.93 octagon: 1 0,0
78LXX = drill 0.813 octagon: GND 0,1.905; IN 1.27,0; OUT -1.27,0
79LXX = drill 0.813 octagon: GND -1.27,0; IN 0,1.905; OUT 1.27,0
TSSOP14 = smd 0.305 x 0.991: 1 -1.905,-2.718; 2 -1.27,-2.718; 3 -0.635,-2.718; 4 0,-2.718; 5 0.635,-2.718; 6 1.27,-2.718; 7 1.905,-2.718; 8 1.905,2.718; 9 1.27,2.718; 10 0.635,2.718; 11 0,2.718; 12 -0.635,2.718; 13 -1.27,2.718; 14 -1.905,2.718
HW4-2.0 = drill 0.8 pad 1.27 square: 1 -3,0 | drill 0.8 pad 1.27: 2 -1,0; 3 1,0; 4 3,0
1X04 = drill 1.016 long: 1 -3.81,0; 2 -1.27,0; 3 1.27,0; 4 3.81,0
2X04 = drill 1.016 octagon: 1 -3.81,-1.27; 2 -3.81,1.27; 3 -1.27,-1.27; 4 -1.27,1.27; 5 1.27,-1.27; 6 1.27,1.27; 7 3.81,-1.27; 8 3.81,1.27
2X10 = drill 1.016 octagon: 1 -11.43,-1.27; 2 -11.43,1.27; 3 -8.89,-1.27; 4 -8.89,1.27; 5 -6.35,-1.27; 6 -6.35,1.27; 7 -3.81,-1.27; 8 -3.81,1.27; 9 -1.27,-1.27; 10 -1.27,1.27; 11 1.27,-1.27; 12 1.27,1.27; 13 3.81,-1.27; 14 3.81,1.27; 15 6.35,-1.27; 16 6.35,1.27; 17 8.89,-1.27; 18 8.89,1.27; 19 11.43,-1.27; 20 11.43,1.27
2X15 = drill 1.016 octagon: 1 -17.78,-1.27; 2 -17.78,1.27; 3 -15.24,-1.27; 4 -15.24,1.27; 5 -12.7,-1.27; 6 -12.7,1.27; 7 -10.16,-1.27; 8 -10.16,1.27; 9 -7.62,-1.27; 10 -7.62,1.27; 11 -5.08,-1.27; 12 -5.08,1.27; 13 -2.54,-1.27; 14 -2.54,1.27; 15 0,-1.27; 16 0,1.27; 17 2.54,-1.27; 18 2.54,1.27; 19 5.08,-1.27; 20 5.08,1.27; 21 7.62,-1.27; 22 7.62,1.27; 23 10.16,-1.27; 24 10.16,1.27; 25 12.7,-1.27; 26 12.7,1.27; 27 15.24,-1.27; 28 15.24,1.27; 29 17.78,-1.27; 30 17.78,1.27
1X02 = drill 1.016 long: 1 -1.27,0; 2 1.27,0
RESC1608X60 = smd 0.799 x 0.974: 1 -0.815,0; 2 0.815,0
R0603 = smd 1 x 1.1: 1 -0.85,0; 2 0.85,0
R0201 = smd 0.28 x 0.43: 1 -0.255,0; 2 0.255,0
21-0055H_16_MXM = smd 1.46 x 0.356: 1 -2.724,2.223; 2 -2.724,1.587; 3 -2.724,0.953; 4 -2.724,0.318; 5 -2.724,-0.318; 6 -2.724,-0.953; 7 -2.724,-1.587; 8 -2.724,-2.223; 9 2.724,-2.223; 10 2.724,-1.587; 11 2.724,-0.953; 12 2.724,-0.318; 13 2.724,0.318; 14 2.724,0.953; 15 2.724,1.587; 16 2.724,2.223
QRE1113 = smd 1.2 x 0.6: 1 -1.8,-0.9; 2 1.8,-0.9; 3 1.8,0.9; 4 -1.8,0.9
TEXAS_SOT23-5 = smd 0.55 x 1.2: 1 -0.95,-1.3; 2 0,-1.3; 3 0.95,-1.3; 4 0.95,1.3; 5 -0.95,1.3
DC-DC_CONVERTER_78XX = drill 0.8: GND 0,0; VIN -2.54,0; VOUT 2.54,0
SOP65P640X120-24N = smd 1.57 x 0.41: 1 -2.87,3.575; 2 -2.87,2.925; 3 -2.87,2.275; 4 -2.87,1.625; 5 -2.87,0.975; 6 -2.87,0.325; 7 -2.87,-0.325; 8 -2.87,-0.975; 9 -2.87,-1.625; 10 -2.87,-2.275; 11 -2.87,-2.925; 12 -2.87,-3.575; 13 2.87,-3.575; 14 2.87,-2.925; 15 2.87,-2.275; 16 2.87,-1.625; 17 2.87,-0.975; 18 2.87,-0.325; 19 2.87,0.325; 20 2.87,0.975; 21 2.87,1.625; 22 2.87,2.275; 23 2.87,2.925; 24 2.87,3.575
CMR0512S3C = drill 0.8 square: P$1 -7.62,0; P$2 -5.08,0; P$3 0,0; P$4 2.54,0; P$5 5.08,0
POT-PTH-ALPS = drill 1 pad 1.88 square: P$1 7,-2.5; P$2 7,0; P$3 7,2.5 | drill 2 octagon: P$4 0,-4.4; P$5 0,4.4
PAK100/2500-16 = drill 1 pad 1.422: 1 -8.89,-1.27; 2 -8.89,1.27; 3 -6.35,-1.27; 4 -6.35,1.27; 5 -3.81,-1.27; 6 -3.81,1.27; 7 -1.27,-1.27; 8 -1.27,1.27; 9 1.27,-1.27; 10 1.27,1.27; 11 3.81,-1.27; 12 3.81,1.27; 13 6.35,-1.27; 14 6.35,1.27; 15 8.89,-1.27; 16 8.89,1.27

### Placement (x,y rotation side)
3V3A_0A  168.66,10.92 0 top
3V3A_0B  249.43,10.67 0 top
3V3A_0C  87.63,10.67 0 top
5V/1  30.99,9.65 0 top
+12VA  22.1,35.31 0 top
+15VA  6.1,35.05 180 top
-12VA  13.97,45.21 180 top
-15VA  6.1,37.59 180 top
C15  74.68,136.91 270 top
C16  76.2,136.91 270 top
C21  83.57,136.4 0 top
C22  83.57,137.67 0 top
C47  19.81,34.29 270 top
C48  14.48,42.93 180 top
C49  3.56,18.03 270 top
C50  3.56,22.1 270 top
C51  18.8,34.29 270 top
C52  14.48,41.91 180 top
C53  4.32,22.35 270 top
C54  4.32,17.78 270 top
C56  32,45.97 0 top
C57  32,35.31 180 top
C58  32.51,44.7 0 top
C59  32.51,36.83 180 top
C117  44.96,8.89 270 top
C118  44.96,4.83 90 top
C119  43.94,9.14 270 top
C120  43.97,4.88 90 top
C121  4.32,10.16 90 top
C122  3.3,10.41 90 top
C123  90.42,136.4 0 top
C158  22.86,41.91 0 top
C162  173.99,-31.24 270 top  (outside the outline)
C164  166.12,-39.62 180 top  (outside the outline)
C182  76.96,132.33 270 top
DGND4  [1X01']  74.42,131.06 0 top
DGND5  30.99,7.11 180 top
IC5  15.24,35.05 180 top
IC6  14.48,39.62 180 top
IC16  32.26,40.64 180 top
J1  362.71,-18.54 90 bottom  (outside the outline)
J36  31.5,53.59 0 top
JP1  93.98,10.92 180 top
JP2  175.01,11.43 180 top
JP3  50.8,28.45 90 top
JP4  131.83,28.7 90 top
JP5  212.6,28.45 90 top
JP6  116.84,28.45 90 top
JP7  197.87,28.7 90 top
JP8  278.64,28.45 90 top
JP9  92.68,6.81 0 top
JP10  173.69,7.09 0 top
JP11  254.43,6.83 0 top
JP12  -25.65,-33.53 90 top  (outside the outline)
JP13  25.15,-33.53 90 top  (outside the outline)
JP14  21.34,52.83 0 top
JP15  255.78,11.43 180 top
JP16  75.95,-33.53 90 top  (outside the outline)
JP17  126.75,-33.53 90 top  (outside the outline)
JP18  177.55,-33.53 90 top  (outside the outline)
JP19  228.35,-33.53 90 top  (outside the outline)
JP20  279.15,-33.53 90 top  (outside the outline)
JP21  329.95,-33.53 90 top  (outside the outline)
OPT_PWR  [1X01']  74.42,133.6 0 top
R1  170.69,143.26 90 top
R2  163.83,139.7 270 top
R3  162.05,143.26 90 top
R6  154.94,139.7 270 top
R7  153.92,143.26 90 top
R8  146.56,139.7 270 top
R9  206.5,29.97 270 top
R10  20.83,47.24 90 top
R11  23.62,46.74 180 top
R12  145.29,143.26 90 top
R13  125.73,29.72 270 top
R14  16.76,9.91 0 top
R15  16.76,12.45 0 top
R16  137.16,139.7 270 top
R17  136.4,143.51 90 top
R18  128.52,139.45 270 top
R19  127.76,143.26 90 top
R20  119.89,139.19 270 top
R21  119.13,143.26 90 top
R22  111.25,139.19 270 top
R23  75.18,143 90 top
R24  69.6,137.16 270 top
R25  110.24,143 90 top
R26  102.11,139.7 270 top
R27  101.6,143 90 top
R28  93.47,139.7 270 top
R29  92.71,143.26 90 top
R30  85.6,140.72 270 top
R31  83.82,143 90 top
R32  75.95,139.7 270 top
R110  16.76,7.62 0 top
R111  16.76,14.99 0 top
R112  29.46,12.95 180 top
R125  168.15,-28.7 180 top  (outside the outline)
R134  165.35,-27.94 90 top  (outside the outline)
R159  35.05,45.21 0 top
R160  34.54,47.75 270 top
R161  36.58,47.75 270 top
R162  38.61,47.75 270 top
R167  28.7,47.5 270 top
R168  26.42,47.5 270 top
R169  28.7,44.96 180 top
R170  34.04,33.27 90 top
R175  36.32,33.27 90 top
R176  35.56,36.07 0 top
R177  30.23,33.27 90 top
R178  27.94,33.27 90 top
R183  29.21,36.07 180 top
R184  43.69,28.45 270 top
R185  13.97,17.53 90 top
R208  28.45,18.03 180 top
R209  28.7,21.59 180 top
U1  320.04,-19.56 270 top  (outside the outline)
U3  167.39,141.48 0 top
U4  158.75,141.48 0 top
U5  150.11,141.48 0 top
U6  141.22,141.48 0 top
U7  132.59,141.48 0 top
U8  123.7,141.48 0 top
U9  115.06,141.48 0 top
U10  106.17,141.48 0 top
U11  97.54,141.48 0 top
U12  88.9,141.48 0 top
U13  80.01,141.22 0 top
U14  71.37,141.22 0 top
U16  79.25,136.91 270 top
U17  41.15,6.86 90 top
U20  168.4,-34.04 0 top  (outside the outline)
U$3  6.1,17.53 90 top
VR1  -10.16,-19.05 270 top  (outside the outline)
VR2  40.64,-19.05 270 top  (outside the outline)
VR3  91.44,-19.05 270 top  (outside the outline)
VR4  142.24,-19.05 270 top  (outside the outline)
VR5  193.04,-19.05 270 top  (outside the outline)
VR6  243.84,-19.05 270 top  (outside the outline)
VR7  294.64,-19.05 270 top  (outside the outline)
VR8  345.44,-19.05 270 top  (outside the outline)
VREGGND  13.97,12.45 180 top
VREGIN  13.97,9.91 180 top
X7  23.62,14.22 90 top
X10  89.41,132.84 0 bottom

### Tracks (layer width: path | path; a pad name or v marks a point on that pad's centre or on a via)
3V3D3  (5 unrouted)
+3.3V  (8 unrouted)
+5V/1  (1 unrouted)
  Top 0.254: C119.1 U17.VOUT
  Top 0.61: C117.1 44.57,9.78 41.53,9.78 U17.VOUT
  pour Route15: 46.48,7.11 29.97,7.11 26.16,10.92 21.08,10.92 19.81,9.65 14.99,9.65 11.68,6.35 9.91,8.13 9.91,12.95 13.46,16.51 19.05,16.51 20.07,17.53 20.07,23.88 20.07,27.43 27.69,27.43 28.96,26.16 35.81,26.16 41.66,20.32 93.98,20.32 101.09,27.43 115.57,41.91 119.89,41.91 119.89,25.91 119.89,25.4 125.73,19.56 178.05,19.56 194.82,36.32 194.82,41.66 195.33,42.16 200.41,42.16 202.69,39.88 202.69,29.21 201.68,28.19 201.42,27.94 201.42,26.16 203.2,24.38 209.55,18.03 219.96,18.03 224.28,22.35 224.28,38.1 240.54,54.36 282.19,54.36 282.19,1.52 48.01,1.52 48.01,5.59
+9V  (via drill 0.55)
  Top 0.254: IC16.4 C58.1 31.37,45.59 31.37,46.87 v31.62,47.12 | C47.1 19.81,35.31 | C51.1 18.8,35.31
  Top 0.305: v31.62,47.12 31.5,47 C56.1
  Top 0.61: IC5.OUT 16.76,35.31 18.8,35.31 19.81,35.31 +12VA.1
  pour Route15 (isolate 0.254): 12.45,36.32 20.57,36.32 21.59,37.34 25.15,37.34 29.46,33.02 34.8,33.02 37.59,35.81 37.59,39.12 36.07,40.64 20.07,40.64 18.54,42.16 18.54,48.26 9.65,48.26 9.65,54.36 9.91,54.61 41.66,54.61 41.66,38.61 45.21,35.05 45.21,33.27 41.4,29.46 13.21,29.46 10.16,32.51 10.16,34.04
+12V
  Top 0.254: C120.1 43.66,4.32 U17.VIN
  Top 0.61: C118.1 44.2,4.33 43.94,4.06 41.4,4.06 U17.VIN
  Top 1.016: R110.2 19.05,6.18 19.05,3.81 19.81,3.05 23.88,3.05 24.89,4.06 X7.1
  pour Route15: 16.76,7.87 26.42,7.87 28.96,5.33 44.96,5.33 45.97,4.32 45.97,1.78 16.51,1.78 13.72,4.57 13.72,5.08 16.51,7.87
-9V  (via drill 0.55)
  Top 0.254: IC16.11 C59.2 31.5,36.06 C57.2 | C52.2 13.21,41.91
  Top 0.305: C57.2 31.5,35.04 32,34.54 v32,34.25
  Top 0.61: IC6.OUT 13.21,41.91 13.98,42.68 C48.2 -12VA.1
  pour Route15 (isolate 0.254): 17.78,47.5 10.41,47.5 10.41,38.1 11.43,37.08 20.07,37.08 21.08,38.1 25.4,38.1 29.46,34.04 34.54,34.04 36.83,36.32 36.83,38.86 35.81,39.88 19.56,39.88 17.78,41.66
A_IN1
  Top 0.406: R184.2 44.03,27.6 46.99,24.64 JP3.2
A_IN2
  Top 0.406: JP4.2 129.03,24.89 125.73,28.19 R13.2
A_IN3
  Top 0.406: JP5.2 210.57,24.64 206.5,28.7 R9.2
A_OUT1  (via drill 0.35)
  Top 0.254: 34.29,48.35 R160.1
  Top 0.406: R160.1 34.54,49.78 35.05,50.29 v35.56,50.29
  Bottom 0.406: 49.28,32.51 49.4,32.39 | 49.4,32.39 JP3.8 | v35.56,50.29 38.86,50.29 49.4,39.75 49.4,32.39
A_OUT1_R  (via drill 0.35)
  Top 0.406: JP3.7 52.07,34.8 51.31,35.56 45.21,35.56 v44.2,34.54 | v30.48,30.99 30.23,31.24 R177.1 | R167.1 28.7,49.28 v29.21,49.78
  Bottom 0.406: v44.2,34.54 39.12,29.46 31.75,29.46 30.48,30.73 v30.48,30.99 27.94,33.53 27.94,43.43 29.21,44.7 v29.21,49.78
A_OUT2  (via drill 0.35)
  Top 0.406: v37.85,51.31 37.85,50.8 36.58,49.53 R161.1
  Bottom 0.406: JP4.8 130.56,40.39 120.51,50.43 58.81,50.43 51.82,43.43 47.5,43.43 39.62,51.31 v37.85,51.31
A_OUT2_R  (via drill 0.35)
  Top 0.406: v50.8,44.45 42.93,36.58 v42.93,36.07 | v35.05,30.73 34.04,31.75 R170.1 | v30.23,50.55 30.1,50.55 29.8,50.85 28.24,50.85 26.42,49.02 R168.1
  Bottom 0.406: JP4.7 133.1,44.45 132.59,44.96 128.13,44.96 121.66,51.44 57.53,51.44 50.8,44.7 v50.8,44.45 | v42.93,36.07 42.93,35.56 38.1,30.73 v35.05,30.73 33.27,32.51 31.5,32.51 30.48,33.53 30.48,37.08 28.93,38.63 28.93,42.28 28.96,42.3 28.96,43.55 29.84,44.44 29.84,48.9 30.23,49.28 v30.23,50.55
A_OUT3  (via drill 0.55)
  Top 0.406: R162.1 41.82,51.82 v43.69,51.82
  Bottom 0.406: JP5.8 211.33,38.35 204.98,44.7 194.56,44.7 189.99,49.28 127.76,49.28 123.7,53.34 56.13,53.34 51.05,48.26 47.24,48.26 v43.69,51.82
A_OUT3_R  (via drill 0.35)
  Top 0.406: JP5.7 213.61,32.51 213.61,34.54 211.33,36.83 v209.3,36.83 | v49.02,45.21 42.93,39.12 40.89,39.12 v38.86,37.08 | v38.86,33.78 37.59,32.51 36.41,32.51 R175.1 36.58,32.17 36.58,30.48 35.81,29.72 29.46,29.72 27.94,31.24 R178.1
  Bottom 0.406: v209.3,36.83 202.44,43.69 193.55,43.69 189.36,47.88 127.13,47.88 122.68,52.32 56.39,52.32 49.28,45.21 v49.02,45.21 | v38.86,37.08 v38.86,33.78
AGND1  (8 unrouted)
AGND5  (via drill 0.35, 0.55, 1)  (1 unrouted)
  Top 0.254: IC16.3 32.89,44.57 C58.2 32.76,45.72 C56.2 | IC16.12 32.89,36.96 C59.1 32.76,35.56 C57.1 | C50.2 3.82,21.34 4.06,21.34 4.32,21.59 C53.2 4.32,21.08 5.33,20.07 | 5.33,20.07 U$3.P$4 | C49.1 3.82,18.8 4.06,18.8 4.32,18.54 C54.1 4.32,19.05 5.33,20.07 | C52.1 14.98,41.91 | C47.2 19.05,33.79 C51.2
  Top 0.305: C56.2 32.77,46.24 32.77,47.24 v33.02,47.24 | IC16.5 31.62,42.29 31.75,42.16 32.69,42.16 32.89,42.37 IC16.3 | IC16.10 31.62,38.61 31.88,38.86 32.69,38.86 32.89,38.66 IC16.12 | C57.1 32.5,35.81 32.68,35.99 v33.45,35.99 33.53,36.07
  Top 0.406: R11.1 24.47,48.09 v24.64,48.26
  Top 0.61: IC6.GND 14.98,40.39 14.98,41.91 C48.1
  Top 0.813: R185.2 v13.97,20.57
  pour Route2: 1.52,16 8.64,16 11.43,18.8 16.51,18.8 17.53,19.81 17.53,28.7 18.54,29.72 27.94,29.72 29.72,27.94 36.83,27.94 42.42,22.35 92.71,22.35 113.79,43.43 121.41,43.43 121.67,43.18 121.67,26.16 126.49,21.34 177.04,21.34 193.04,37.34 193.04,42.42 194.31,43.69 201.68,43.69 204.47,40.89 204.47,28.45 203.2,27.18 210.57,19.81 218.95,19.81 222,22.86 222,38.1 203.96,56.13 0.25,56.13 0.25,17.27
CGND  (31 unrouted)
  pour Route2: 172.97,129.03 172.97,145.8 66.8,145.8 66.8,129.03
DGND4
  Top 0.254: U17.GND 41.4,6.86 42.24,6.86 42.33,6.77 | 42.33,6.77 C120.2 | C119.2 42.33,7.28 42.33,6.77
  Top 0.813: R185.1 16.85,16.68 17.78,15.75 17.78,15.15 R111.2 R15.2 18.54,12.45 20.32,10.67 20.32,9.14 21.59,7.87 X7.4 | C117.2 42.93,8.39 41.4,6.86 42.67,6.86 43.95,5.58 44.7,5.58 C118.2
  pour Route2: 0.25,0.25 0.25,13.97 0,14.22 9.4,14.22 12.7,17.53 17.53,17.53 19.05,19.05 19.05,27.94 27.69,27.94 27.94,28.19 29.46,26.67 36.32,26.67 41.91,21.08 93.73,21.08 114.81,42.16 114.81,42.42 120.4,42.42 120.4,25.65 125.98,20.07 177.8,20.07 194.31,36.58 194.31,41.91 195.07,42.67 200.66,42.67 203.2,40.13 203.2,28.96 201.93,27.69 201.93,26.42 209.8,18.54 219.96,18.54 223.77,22.35 223.77,38.35 240.79,55.37 282.96,55.37 282.96,0.76 282.45,0.25
GND-ISO  (5 unrouted)
N$1  (1 unrouted)
N$2  (1 unrouted)
N$3  (1 unrouted)
N$4  (1 unrouted)
N$5  (1 unrouted)
N$6  (1 unrouted)
N$7  (1 unrouted)
N$8  (1 unrouted)
N$9  (1 unrouted)
N$10
  Top 0.254: IC16.6 30.99,44.45 30.48,44.96 R169.1 29.46,45.05 29.46,45.89 28.78,46.56 R167.2 R168.2
N$11  (1 unrouted)
N$12  (1 unrouted)
N$13  (2 unrouted)
N$14  (2 unrouted)
N$15  (1 unrouted)
N$27
  Top 0.254: IC16.2 33.53,44.54 R159.1 34.54,45.55 R160.2 R161.2 R162.2
N$28  (via drill 0.55)
  Top 0.254: IC16.7 30.23,43.36 | 30.23,43.36 29.03,43.36 27.85,44.54 R169.2 | 44.2,49.78 42.93,49.78 41.66,48.51 41.66,46.48 39.37,44.2 39.37,42.16 38.61,41.4 35.81,41.4 35.56,41.15 v35.56,40.89 | v29.84,41.91 30.23,42.29 30.23,43.36
  Top 0.406: R9.1 206.5,49.53 202.18,53.85 139.45,53.85 134.11,48.51 126.24,48.51 121.41,53.34 57.15,53.34 52.32,48.51 45.47,48.51 44.2,49.78
  Bottom 0.254: v35.56,40.89 30.99,40.89 29.97,41.91 v29.85,41.91 v29.84,41.91
N$29
  Top 0.254: R183.1 30.14,35.98 | 30.14,35.98 30.23,35.9 R177.2 R178.2 | IC16.9 30.99,37.08 30.14,36.24 30.14,35.98
N$30
  Top 0.254: C50.1 C53.1 U$3.P$5
  Top 0.813: IC5.IN +15VA.1 U$3.P$5
N$32
  Top 0.254: IC16.1 34.39,43.59 34.49,43.69 35.56,43.69 35.9,44.03 R159.2
  Top 0.61: C158.+ 26.67,41.91 28.19,40.39 32.77,40.39 34.54,42.16 34.54,43.43 34.39,43.59
N$33  (1 unrouted)
N$34
  Top 0.254: U$3.P$3 C54.2 C49.2
  Top 0.813: IC6.IN 6.22,37.72 -15VA.1 1.78,33.27 1.78,17.78 2.29,17.27 5.84,17.27 U$3.P$3
N$35  (1 unrouted)
N$36  (1 unrouted)
N$37  (1 unrouted)
N$38  (1 unrouted)
N$39  (1 unrouted)
N$40  (1 unrouted)
N$41  (1 unrouted)
N$42  (1 unrouted)
N$105  (1 unrouted)
  Top 0.254: C121.2 4.32,10.92 4.06,11.18 3.3,11.18
  Top 0.61: R15.1 VREGGND.1 U$3.P$2 3.81,12.45 3.3,11.94 3.3,11.18 C122.2
N$106  (1 unrouted)
  Top 0.254: C121.1 4.32,9.4
  Top 0.61: R14.1 VREGIN.1 U$3.P$1 5.59,9.4 4.32,9.4 3.82,9.4 C122.1
N$174  (1 unrouted)
N$246
  Top 0.254: R183.2 28.36,36.74 29.21,37.59 30.02,37.59 IC16.8 30.23,38.05 30.23,39.12 30.48,39.37 38.35,39.37 40.64,41.66 40.64,43.18 44.2,46.74
  Top 0.406: R13.1 125.48,30.82 125.48,47.5 121.16,51.82 57.91,51.82 52.83,46.74 44.2,46.74
N$249
  Top 0.61: R10.1 20.83,42.28 C158.-
N$251
  Top 0.254: IC16.14 34.75,37.34 36.32,37.34 36.49,37.17 36.49,35.98
  Top 0.406: R184.1 43.69,33.27 41.15,35.81 36.66,35.81 36.49,35.98 R176.2
N$252
  Top 0.254: IC16.13 33.53,37.08 34.54,36.07 R176.1 34.04,35.39 R170.2 R175.2
N$265
  Top 0.406: JP14.1 20.07,48.86 R10.2 22.52,48.09 22.61,48.01 R11.2 22.77,48.43 25.15,50.8 25.7,50.8 J36.1
  Bottom 0.406: J36.1 J36.2
N$284
  Top 0.254: R209.2 28.19,21.59 26.67,23.11 X7.15
N$293
  Top 0.254: X7.11 R208.2
N$294
  Top 0.254: X7.7 R112.2
N$298
  Top 0.254: JP1.4 90.17,10.16 88.9,8.89 88.9,6.78 JP9.13
  Top 0.305: JP9.13 90.17,5.51
N$299
  Top 0.254: 3V3A_0C.1 87.63,8.1 JP9.12
N$300
  Top 0.254: JP1.2 95.25,10.16 93.98,8.89 93.98,6.35 93.17,5.54 JP9.15
N$309  (1 unrouted)
N$310
  Bottom 0.254: 3V3A_0B.1 249.43,8.18 JP11.12
OPT1  (2 unrouted)
OPT2  (2 unrouted)
OPT3  (2 unrouted)
OPT4  (2 unrouted)
OPT5  (2 unrouted)
OPT6  (2 unrouted)
OPT7  (2 unrouted)
OPT8  (2 unrouted)
OPT9  (2 unrouted)
OPT10  (2 unrouted)
OPT11  (2 unrouted)
OPT12  (2 unrouted)
OPT_PWR  (16 unrouted)
  pour Route15: 66.8,145.8 66.8,141.73 172.72,141.73 172.72,145.8
OPT_PWR_EN  (1 unrouted)
OPT_PWR_SW  (16 unrouted)
  pour Route15: 66.8,140.72 66.8,129.03 172.72,129.03 172.72,140.72
PA0-2
  Bottom 0.305: JP2.4 171.2,10.41 169.93,9.14 169.93,7.04 JP10.13
PA0-3
  Bottom 0.305: JP15.4 251.97,10.16 250.7,8.89 250.7,6.76 JP11.13
PA1-2
  Bottom 0.305: JP2.3 173.74,10.95 JP10.14
PA1-3
  Bottom 0.305: JP11.14 251.89,8.81 JP15.3
PA1_1
  Top 0.254: JP1.3 92.71,10.64 JP9.14
PA2-2
  Bottom 0.305: JP2.2 176.28,10.16 175.01,8.89 175.01,6.6 174.22,5.82 JP10.15
PA2-3
  Bottom 0.305: JP11.15 255.78,6.91 255.78,10.16 JP15.2
PA3-2
  Bottom 0.305: JP2.1 178.05,12.19 178.05,12.95 177.29,13.72 175.51,13.72 175.01,13.21 175.01,9.68 JP10.16
PA3-3
  Top 0.305: JP15.1 257.56,9.4 255.02,9.4 254.43,8.81 JP11.16
PA3_1
  Bottom 0.254: JP1.1 97.28,11.43 97.28,12.19 96.52,12.95 94.23,12.95 93.98,12.7 93.98,9.37 JP9.16
SPI1_CS  (via drill 0.35)
  Top 0.254: X7.9 29.46,15.49 30.48,16.51 95,16.51 v95.88,15.62 99.31,12.19 99.31,9.14 99.06,8.89 99.06,7.37 98.55,6.86 96.54,6.86 JP9.17 | v164.85,11.18 164.85,11.43 167.13,13.72 179.83,13.72 180.85,12.7 180.85,10.67 179.73,9.55 178.35,9.55 178.28,9.62 177.77,9.62 177.55,9.4 177.55,7.11 177.52,7.11 JP10.17 178.23,3.81 v185.17,3.81 | v243.99,3.22 223.09,3.22 218.44,7.87 v218.31,7.75
  Bottom 0.254: v164.85,11.18 160.78,15.24 96.01,15.24 95.76,15.49 v95.88,15.62 | JP11.17 253.44,2.03 245.36,2.03 244.18,3.22 v243.99,3.22 | v218.31,7.75 217.04,7.75 214.63,10.16 198.12,10.16 191.77,3.81 v185.17,3.81
SPI1_MISO  (via drill 0.35)
  Top 0.254: R208.1 96.01,18.03 101.6,12.45 101.6,7.11 101.35,6.86 99.57,6.86 98.25,5.54 JP9.19 | v157.48,11.43 161.29,15.24 180.59,15.24 180.85,15.24 | 180.85,15.24 181.36,15.24 v182.63,13.97 | v181.36,15.75 180.85,15.24
  Bottom 0.254: JP9.19 97.76,3.84 98.55,3.05 123.95,3.05 132.33,11.43 v157.48,11.43 | v182.63,13.97 182.63,12.45 180.09,9.91 180.09,6.6 179.3,5.82 JP10.19 | JP11.19 260.81,6.86 260.86,6.86 260.86,9.65 261.37,10.16 261.37,13.72 259.33,15.75 v181.36,15.75
SPI1_MOSI  (via drill 0.35)
  Top 0.254: X7.12 23.62,16.76 29.21,16.76 29.97,17.53 95.25,17.53 v100.58,12.19 | v167.13,2.29 166.37,1.52 138.68,1.52 129.79,10.41 103.38,10.41 103.12,10.67 v102.87,10.41 | JP11.20 261.37,9.96 261.37,13.46 261.11,13.72 185.17,13.72 v184.91,13.46
  Bottom 0.254: v100.58,12.19 100.58,10.92 100.08,10.41 | JP9.20 97.76,8.1 100.08,10.41 | JP10.20 178.76,7.82 177.55,6.6 177.55,4.06 | 177.55,4.06 177.04,3.56 167.89,3.56 167.13,2.79 v167.13,2.29 | v102.87,10.41 100.08,10.41 | v184.91,13.46 184.91,12.45 182.63,10.16 182.63,4.83 181.61,3.81 177.8,3.81 177.55,4.06
SPI1_SCK  (via drill 0.35)
  Top 0.254: X7.10 23.62,14.22 29.72,14.22 31.24,15.75 93.47,15.75 96.52,12.7 96.52,9.34 95.26,8.08 JP9.18 | v162.81,2.79 164.85,4.83 164.85,6.86 165.1,7.11 175.01,7.11 176.22,8.33 JP10.18 175.01,7.14 175.01,4.57 176.53,3.05 192.28,3.05 198.37,9.14 232.16,9.14 234.7,6.6 235.2,6.6 235.46,6.86 256.54,6.86 256.97,7.29 JP11.18
  Bottom 0.254: JP9.18 94,6.86 93.98,6.86 93.98,3.3 95,2.29 124.36,2.29 129.35,7.28 131.61,7.28 136.6,2.29 162.05,2.29 162.56,2.79 v162.81,2.79
SPI2_CS
  Top 0.254: JP8.3 278.64,20.83 276.1,20.83 271.78,16.51 203.71,16.51 200.41,19.81 JP7.3 199.14,20.32 198.37,21.08 194.56,21.08 191.77,18.29 121.41,18.29 120.14,19.56 JP6.3 117.86,19.56 116.84,20.57 114.3,20.57 113.03,19.3 33.02,19.3 32.26,20.07 25.4,20.07 X7.13
SPI2_MISO  (via drill 0.35)
  Top 0.254: v29.97,21.84 29.72,21.59 R209.1
  Bottom 0.254: JP8.5 279.65,22.1 278.38,23.37 276.1,23.37 270.26,17.53 205.74,17.53 200.91,22.35 JP7.5 197.87,21.08 190.5,21.08 186.44,17.02 123.7,17.02 118.62,22.1 JP6.5 117.6,22.1 116.33,20.83 97.54,20.83 92.46,15.75 37.08,15.75 30.99,21.84 v29.97,21.84
SPI2_MOSI
  Top 0.254: X7.16 22.86,23.11 24.13,21.84 25.91,21.84 26.92,20.83 32.77,20.83 33.53,20.07 112.78,20.07 114.3,21.59 115.06,21.59 JP6.6 116.84,23.37 119.89,23.37 121.16,22.1 121.16,19.56 121.67,19.05 191.52,19.05 194.56,22.1 196.34,22.1 JP7.6 197.87,23.62 199.64,23.62 205.99,17.27 271.27,17.27 276.1,22.1 JP8.6
SPI2_SCK
  Top 0.254: X7.14 22.61,20.57 23.88,19.3 29.72,19.3 30.23,18.8 114.81,18.8 JP6.4 | 115.32,19.3 JP6.4 | JP6.4 116.84,18.29 119.63,18.29 120.65,17.27 192.53,17.27 195.07,19.81 JP7.4 197.61,18.8 197.61,18.54 199.9,18.54 202.95,15.49 272.54,15.49 276.61,19.56 JP8.4
SPI5_CS
  Top 0.254: JP11.9 246.81,4.5 244.35,2.03 220.73,2.03 214.88,7.87 198.88,7.87 193.04,2.03 169.85,2.03 JP10.9
  Top 0.305: X7.5 27.69,7.62 27.69,2.79 28.7,1.78 33.53,1.78 33.74,1.56 82.84,1.56 85.34,4.06 85.34,5.26 JP9.9
  Bottom 0.254: JP10.9 166.06,4.27 163.58,1.78 87.63,1.78 85.06,4.34 JP9.9
SPI5_MISO
  Top 0.254: R112.1 31.75,14.99 80.73,14.99 85.57,10.14 85.57,9.93 86.36,9.14 86.36,7.37 85.85,6.86 83.31,6.86 82.53,6.07 JP9.7
  Bottom 0.254: JP9.7 82.53,3.07 84.44,1.16 164.59,1.16 | 164.59,1.16 168.79,1.16 170.18,2.54 192.28,2.54 198.12,8.38 215.14,8.38 220.98,2.54 241.81,2.54 244.27,5 JP11.7 | JP10.7 163.52,6.55 164.08,7.11 166.88,7.11 167.39,6.6 167.39,4.06 164.97,1.65 164.97,1.54 164.59,1.16
SPI5_MOSI
  Top 0.254: JP11.8 244.27,9.12 240.68,12.71 182.12,12.45 180.34,14.22 166.37,14.22 163.52,11.38 JP10.8
  Bottom 0.254: JP10.8 158.17,13.72 87.63,13.72 86.11,12.19 86.11,9.4 86.36,9.14 86.36,7.37 85.85,6.86 83.79,6.86 82.55,8.1
  Bottom 0.305: X7.8 23.76,11.55 31.87,11.55 34.29,13.97 77.72,13.97 82.55,9.14 82.55,8.1 JP9.8
SPI5_SCK
  Top 0.305: X7.6 23.29,10.41 24.42,11.55 32.38,11.55 35.05,14.22 80.77,14.22 85.06,9.93 JP9.10
  Bottom 0.254: JP9.10 85.06,12.17 87.38,14.48 159.94,14.48 JP10.10 166.06,11.38 169.42,14.73 241.55,14.73 246.81,9.47 JP11.10

### Text on the board
tPlace: + | - | + | I | - | G | H
Patch_BOT: Lout | Rout | Lout | Rout | Lout | Rout | DGND | 5Vin | DGND | 5Vin | DGND | 5Vin | I2C4 | I2C4 | PD13 | SDA | PD13 | PD13 | SDA | PC6 | PC6 | PC6 | SCL | SCL | PD12 | D11 | PD12 | D11 | SCL | PD12 | D11 | Lin | Lin | Rin | MISO | Rin | MOSI | PB15 | PB14 | Lin | Rin | MISO | MOSI | PB15 | PB14 | MOSI | PB15 | PB14 | SCLK | PB13 | PB12 | CS | SCLK | PB13 | PB12 | SCLK | PB13 | PB12 | CS | 3v3a | 3v3a | 3v3D | 3v3a | PG10 | 3v3D | DGND | PG10 | DGND | PG10 | 3v3D | DGND | PA3 | PA5 | PC5 | PA1 | PA3 | PA5 | PA7 | PC5 | PB1 | PD7 | SCL | PA1 | PA7 | PB1 | PD7 | SCL | PA1 | PA3 | PA5 | PA7 | PC5 | PB1 | PD7 | SCL | AGND | PA4 | PA6 | PC4 | PB0 | SDA | AGND | PA0 | PA2 | PA4 | PA6 | PC4 | PB0 | PG9 | PG12 | SDA | AGND | PA4 | PA6 | PC4 | PB0 | SDA | PA0 | PA2 | PG9 | PG12 | PA0 | PA2 | PG9 | PG12